# Altium project TP_FINAL.PrjPcb
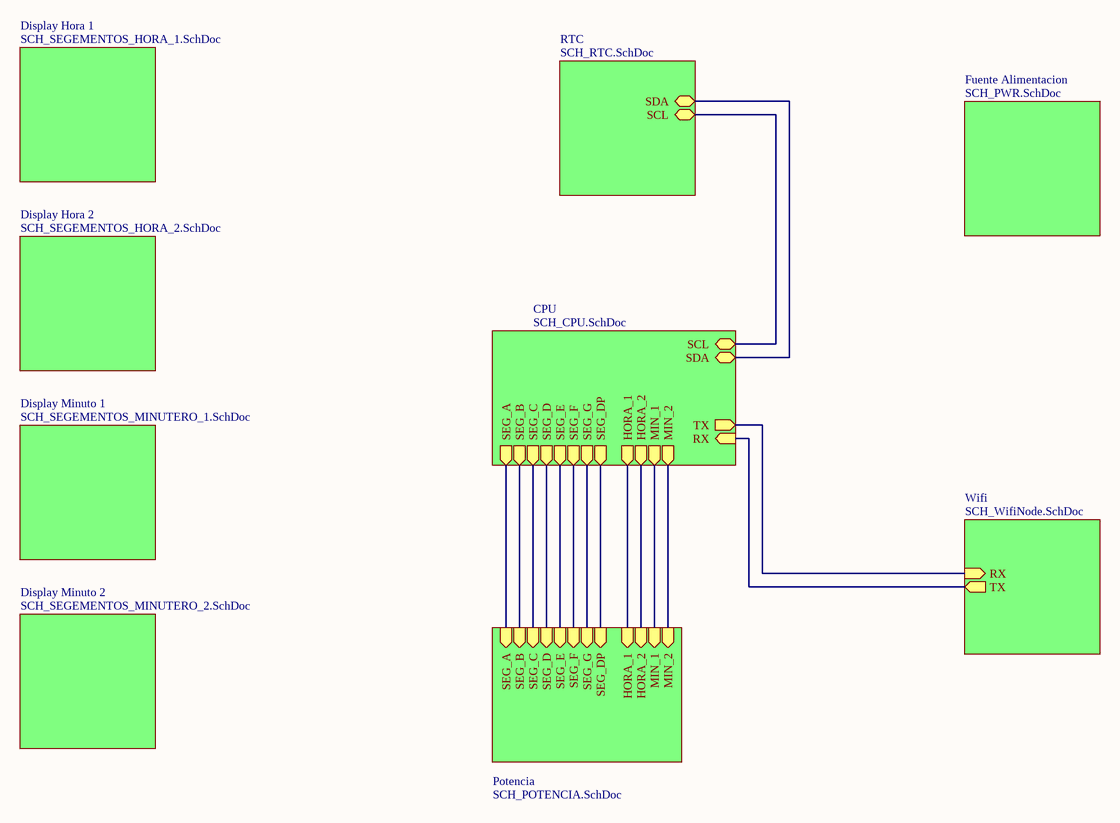
[diagram p0: SCH_TOP.SchDoc]
10 sheets, 493 parts. Net scope: hierarchical (ports join the sheet entries above them; power ports are global).
Sheets:
  SCH_TOP.SchDoc
    Display Hora 2 = SCH_SEGEMENTOS_HORA_2.SchDoc
    CPU = SCH_CPU.SchDoc
    Wifi = SCH_WifiNode.SchDoc
    RTC = SCH_RTC.SchDoc
    Potencia = SCH_POTENCIA.SchDoc
    Display Hora 1 = SCH_SEGEMENTOS_HORA_1.SchDoc
    Display Minuto 1 = SCH_SEGEMENTOS_MINUTERO_1.SchDoc
    Display Minuto 2 = SCH_SEGEMENTOS_MINUTERO_2.SchDoc
    Fuente Alimentacion = SCH_PWR.SchDoc

## Sheet SCH_TOP.SchDoc: TP Final - Reloj - BLK
size A4; Author: Luciano Lopez; CompanyName: UTN - FRBA; Revision: 1; SheetNumber: 1; SheetTotal: 10

### Sub-sheets
CPU = SCH_CPU.SchDoc: SCL (bidir), SDA (bidir), TX (out), RX (in), HORA_2 (out), HORA_1 (out), SEG_G (out), SEG_F (out), SEG_D (out), SEG_E (out), SEG_C (out), SEG_B (out), SEG_A (out), MIN_1 (out), MIN_2 (out), SEG_DP (out)
Display Hora 1 = SCH_SEGEMENTOS_HORA_1.SchDoc: no entries
Display Hora 2 = SCH_SEGEMENTOS_HORA_2.SchDoc: no entries
Display Minuto 1 = SCH_SEGEMENTOS_MINUTERO_1.SchDoc: no entries
Display Minuto 2 = SCH_SEGEMENTOS_MINUTERO_2.SchDoc: no entries
Fuente Alimentacion = SCH_PWR.SchDoc: no entries
Potencia = SCH_POTENCIA.SchDoc: SEG_B (in), SEG_C (in), SEG_D (in), SEG_E (in), SEG_G (in), SEG_F (in), SEG_DP (in), HORA_1 (in), HORA_2 (in), MIN_1 (in), MIN_2 (in), SEG_A (in)
RTC = SCH_RTC.SchDoc: SDA (bidir), SCL (bidir)
Wifi = SCH_WifiNode.SchDoc: TX (out), RX (in)

### Nets
SCL: sheet CPU/SCL, sheet RTC/SCL
SDA: sheet CPU/SDA, sheet RTC/SDA
NetR8_1: sheet CPU/SEG_DP, sheet Potencia/SEG_DP
NetR9_1: sheet CPU/HORA_1, sheet Potencia/HORA_1
NetR12_1: sheet CPU/SEG_A, sheet Potencia/SEG_A
NetR13_1: sheet CPU/HORA_2, sheet Potencia/HORA_2
NetR16_1: sheet CPU/SEG_B, sheet Potencia/SEG_B
NetR17_1: sheet CPU/MIN_1, sheet Potencia/MIN_1
NetR20_1: sheet CPU/SEG_C, sheet Potencia/SEG_C
NetR21_1: sheet CPU/MIN_2, sheet Potencia/MIN_2
NetR24_1: sheet CPU/SEG_D, sheet Potencia/SEG_D
NetR26_1: sheet CPU/SEG_G, sheet Potencia/SEG_G
NetR28_1: sheet CPU/SEG_E, sheet Potencia/SEG_E
NetR30_1: sheet CPU/SEG_F, sheet Potencia/SEG_F
NetU1_30: sheet CPU/RX, sheet Wifi/TX
NetU1_31: sheet CPU/TX, sheet Wifi/RX

### Notes on the sheet
- Title:
- Size:
- Author:
- A4
- Sheet
- of
- Revision:
- File:
- Date:

## Sheet SCH_SEGEMENTOS_HORA_2.SchDoc: TP Final - Reloj - Display Hora 2
size A4; Author: Luciano Lopez; CompanyName: UTN - FRBA; Revision: 1; SheetNumber: 6; SheetTotal: 10
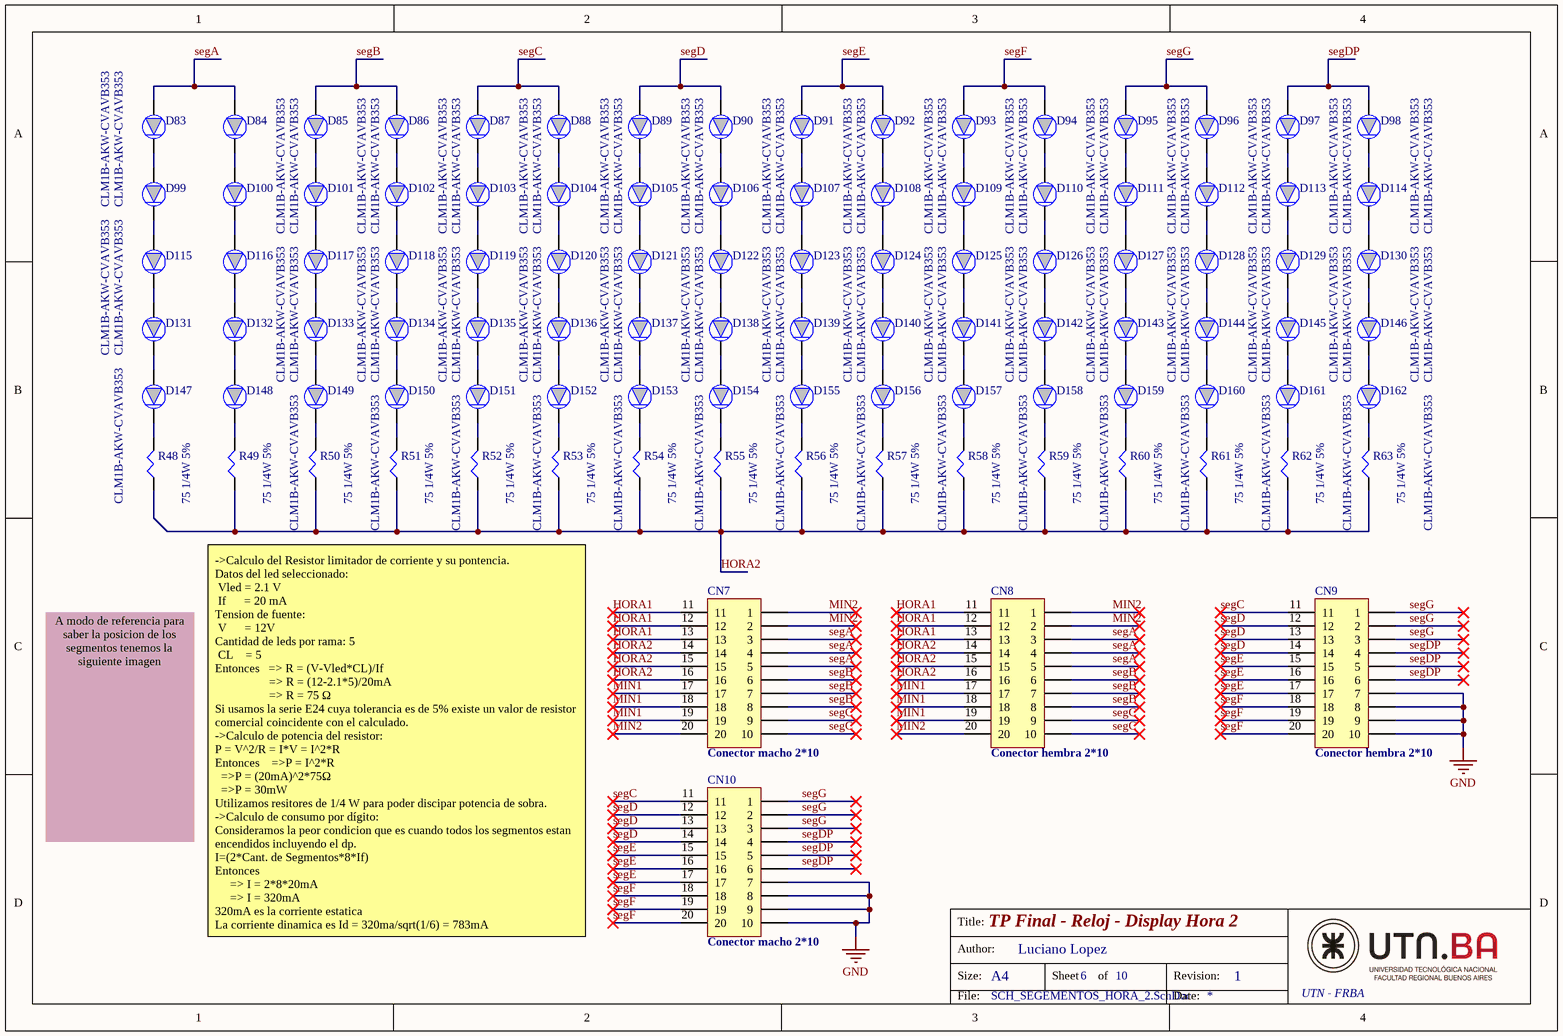
[diagram p1: SCH_SEGEMENTOS_HORA_2.SchDoc]

### Parts
CN7  Conector macho 2*10
CN8  Conector hembra 2*10
CN9  Conector hembra 2*10
CN10  Conector macho 2*10
D83  CLM1B-AKW-CVAVB353  [PLCC2_LED]
D84  CLM1B-AKW-CVAVB353  [PLCC2_LED]
D85  CLM1B-AKW-CVAVB353  [PLCC2_LED]
D86  CLM1B-AKW-CVAVB353  [PLCC2_LED]
D87  CLM1B-AKW-CVAVB353  [PLCC2_LED]
D88  CLM1B-AKW-CVAVB353  [PLCC2_LED]
D89  CLM1B-AKW-CVAVB353  [PLCC2_LED]
D90  CLM1B-AKW-CVAVB353  [PLCC2_LED]
D91  CLM1B-AKW-CVAVB353  [PLCC2_LED]
D92  CLM1B-AKW-CVAVB353  [PLCC2_LED]
D93  CLM1B-AKW-CVAVB353  [PLCC2_LED]
D94  CLM1B-AKW-CVAVB353  [PLCC2_LED]
D95  CLM1B-AKW-CVAVB353  [PLCC2_LED]
D96  CLM1B-AKW-CVAVB353  [PLCC2_LED]
D97  CLM1B-AKW-CVAVB353  [PLCC2_LED]
D98  CLM1B-AKW-CVAVB353  [PLCC2_LED]
D99  CLM1B-AKW-CVAVB353  [PLCC2_LED]
D100  CLM1B-AKW-CVAVB353  [PLCC2_LED]
D101  CLM1B-AKW-CVAVB353  [PLCC2_LED]
D102  CLM1B-AKW-CVAVB353  [PLCC2_LED]
D103  CLM1B-AKW-CVAVB353  [PLCC2_LED]
D104  CLM1B-AKW-CVAVB353  [PLCC2_LED]
D105  CLM1B-AKW-CVAVB353  [PLCC2_LED]
D106  CLM1B-AKW-CVAVB353  [PLCC2_LED]
D107  CLM1B-AKW-CVAVB353  [PLCC2_LED]
D108  CLM1B-AKW-CVAVB353  [PLCC2_LED]
D109  CLM1B-AKW-CVAVB353  [PLCC2_LED]
D110  CLM1B-AKW-CVAVB353  [PLCC2_LED]
D111  CLM1B-AKW-CVAVB353  [PLCC2_LED]
D112  CLM1B-AKW-CVAVB353  [PLCC2_LED]
D113  CLM1B-AKW-CVAVB353  [PLCC2_LED]
D114  CLM1B-AKW-CVAVB353  [PLCC2_LED]
D115  CLM1B-AKW-CVAVB353  [PLCC2_LED]
D116  CLM1B-AKW-CVAVB353  [PLCC2_LED]
D117  CLM1B-AKW-CVAVB353  [PLCC2_LED]
D118  CLM1B-AKW-CVAVB353  [PLCC2_LED]
D119  CLM1B-AKW-CVAVB353  [PLCC2_LED]
D120  CLM1B-AKW-CVAVB353  [PLCC2_LED]
D121  CLM1B-AKW-CVAVB353  [PLCC2_LED]
D122  CLM1B-AKW-CVAVB353  [PLCC2_LED]
D123  CLM1B-AKW-CVAVB353  [PLCC2_LED]
D124  CLM1B-AKW-CVAVB353  [PLCC2_LED]
D125  CLM1B-AKW-CVAVB353  [PLCC2_LED]
D126  CLM1B-AKW-CVAVB353  [PLCC2_LED]
D127  CLM1B-AKW-CVAVB353  [PLCC2_LED]
D128  CLM1B-AKW-CVAVB353  [PLCC2_LED]
D129  CLM1B-AKW-CVAVB353  [PLCC2_LED]
D130  CLM1B-AKW-CVAVB353  [PLCC2_LED]
D131  CLM1B-AKW-CVAVB353  [PLCC2_LED]
D132  CLM1B-AKW-CVAVB353  [PLCC2_LED]
D133  CLM1B-AKW-CVAVB353  [PLCC2_LED]
D134  CLM1B-AKW-CVAVB353  [PLCC2_LED]
D135  CLM1B-AKW-CVAVB353  [PLCC2_LED]
D136  CLM1B-AKW-CVAVB353  [PLCC2_LED]
D137  CLM1B-AKW-CVAVB353  [PLCC2_LED]
D138  CLM1B-AKW-CVAVB353  [PLCC2_LED]
D139  CLM1B-AKW-CVAVB353  [PLCC2_LED]
D140  CLM1B-AKW-CVAVB353  [PLCC2_LED]
D141  CLM1B-AKW-CVAVB353  [PLCC2_LED]
D142  CLM1B-AKW-CVAVB353  [PLCC2_LED]
D143  CLM1B-AKW-CVAVB353  [PLCC2_LED]
D144  CLM1B-AKW-CVAVB353  [PLCC2_LED]
D145  CLM1B-AKW-CVAVB353  [PLCC2_LED]
D146  CLM1B-AKW-CVAVB353  [PLCC2_LED]
D147  CLM1B-AKW-CVAVB353  [PLCC2_LED]
D148  CLM1B-AKW-CVAVB353  [PLCC2_LED]
D149  CLM1B-AKW-CVAVB353  [PLCC2_LED]
D150  CLM1B-AKW-CVAVB353  [PLCC2_LED]
D151  CLM1B-AKW-CVAVB353  [PLCC2_LED]
D152  CLM1B-AKW-CVAVB353  [PLCC2_LED]
D153  CLM1B-AKW-CVAVB353  [PLCC2_LED]
D154  CLM1B-AKW-CVAVB353  [PLCC2_LED]
D155  CLM1B-AKW-CVAVB353  [PLCC2_LED]
D156  CLM1B-AKW-CVAVB353  [PLCC2_LED]
D157  CLM1B-AKW-CVAVB353  [PLCC2_LED]
D158  CLM1B-AKW-CVAVB353  [PLCC2_LED]
D159  CLM1B-AKW-CVAVB353  [PLCC2_LED]
D160  CLM1B-AKW-CVAVB353  [PLCC2_LED]
D161  CLM1B-AKW-CVAVB353  [PLCC2_LED]
D162  CLM1B-AKW-CVAVB353  [PLCC2_LED]
R48  75 1/4W 5%  [R_0805]
R49  75 1/4W 5%  [R_0805]
R50  75 1/4W 5%  [R_0805]
R51  75 1/4W 5%  [R_0805]
R52  75 1/4W 5%  [R_0805]
R53  75 1/4W 5%  [R_0805]
R54  75 1/4W 5%  [R_0805]
R55  75 1/4W 5%  [R_0805]
R56  75 1/4W 5%  [R_0805]
R57  75 1/4W 5%  [R_0805]
R58  75 1/4W 5%  [R_0805]
R59  75 1/4W 5%  [R_0805]
R60  75 1/4W 5%  [R_0805]
R61  75 1/4W 5%  [R_0805]
R62  75 1/4W 5%  [R_0805]
R63  75 1/4W 5%  [R_0805]

### Nets
GND: CN9.7 CN9.8 CN9.9 CN9.10 CN10.7 CN10.8 CN10.9 CN10.10
HORA1: CN7.11 CN7.12 CN7.13 CN8.11 CN8.12 CN8.13
HORA2: CN7.14 CN7.15 CN7.16 CN8.14 CN8.15 CN8.16 R48.47 R49.47 R50.47 R51.47 R52.47 R53.47 R54.47 R55.47 R56.47 R57.47 R58.47 R59.47 R60.47 R61.47 R62.47 R63.47
MIN1: CN7.17 CN7.18 CN7.19 CN8.17 CN8.18 CN8.19
MIN2: CN7.1 CN7.2 CN7.20 CN8.1 CN8.2 CN8.20
segA: CN7.3 CN7.4 CN7.5 CN8.3 CN8.4 CN8.5 D83.12 D84.12
segB: CN7.6 CN7.7 CN7.8 CN8.6 CN8.7 CN8.8 D85.12 D86.12
segC: CN7.9 CN7.10 CN8.9 CN8.10 CN9.11 CN10.11 D87.12 D88.12
segD: CN9.12 CN9.13 CN9.14 CN10.12 CN10.13 CN10.14 D89.12 D90.12
segDP: CN9.4 CN9.5 CN9.6 CN10.4 CN10.5 CN10.6 D97.12 D98.12
segE: CN9.15 CN9.16 CN9.17 CN10.15 CN10.16 CN10.17 D91.12 D92.12
segF: CN9.18 CN9.19 CN9.20 CN10.18 CN10.19 CN10.20 D93.12 D94.12
segG: CN9.1 CN9.2 CN9.3 CN10.1 CN10.2 CN10.3 D95.12 D96.12
NetD83_11: D83.11 D99.12
NetD84_11: D84.11 D100.12
NetD85_11: D85.11 D101.12
NetD86_11: D86.11 D102.12
NetD87_11: D87.11 D103.12
NetD88_11: D88.11 D104.12
NetD89_11: D89.11 D105.12
NetD90_11: D90.11 D106.12
NetD91_11: D91.11 D107.12
NetD92_11: D92.11 D108.12
NetD93_11: D93.11 D109.12
NetD94_11: D94.11 D110.12
NetD95_11: D95.11 D111.12
NetD96_11: D96.11 D112.12
NetD97_11: D97.11 D113.12
NetD98_11: D98.11 D114.12
NetD99_11: D99.11 D115.12
NetD100_11: D100.11 D116.12
NetD101_11: D101.11 D117.12
NetD102_11: D102.11 D118.12
NetD103_11: D103.11 D119.12
NetD104_11: D104.11 D120.12
NetD105_11: D105.11 D121.12
NetD106_11: D106.11 D122.12
NetD107_11: D107.11 D123.12
NetD108_11: D108.11 D124.12
NetD109_11: D109.11 D125.12
NetD110_11: D110.11 D126.12
NetD111_11: D111.11 D127.12
NetD112_11: D112.11 D128.12
NetD113_11: D113.11 D129.12
NetD114_11: D114.11 D130.12
NetD115_11: D115.11 D131.12
NetD116_11: D116.11 D132.12
NetD117_11: D117.11 D133.12
NetD118_11: D118.11 D134.12
NetD119_11: D119.11 D135.12
NetD120_11: D120.11 D136.12
NetD121_11: D121.11 D137.12
NetD122_11: D122.11 D138.12
NetD123_11: D123.11 D139.12
NetD124_11: D124.11 D140.12
NetD125_11: D125.11 D141.12
NetD126_11: D126.11 D142.12
NetD127_11: D127.11 D143.12
NetD128_11: D128.11 D144.12
NetD129_11: D129.11 D145.12
NetD130_11: D130.11 D146.12
NetD131_11: D131.11 D147.12
NetD132_11: D132.11 D148.12
NetD133_11: D133.11 D149.12
NetD134_11: D134.11 D150.12
NetD135_11: D135.11 D151.12
NetD136_11: D136.11 D152.12
NetD137_11: D137.11 D153.12
NetD138_11: D138.11 D154.12
NetD139_11: D139.11 D155.12
NetD140_11: D140.11 D156.12
NetD141_11: D141.11 D157.12
NetD142_11: D142.11 D158.12
NetD143_11: D143.11 D159.12
NetD144_11: D144.11 D160.12
NetD145_11: D145.11 D161.12
NetD146_11: D146.11 D162.12
NetD147_11: D147.11 R48.48
NetD148_11: D148.11 R49.48
NetD149_11: D149.11 R50.48
NetD150_11: D150.11 R51.48
NetD151_11: D151.11 R52.48
NetD152_11: D152.11 R53.48
NetD153_11: D153.11 R54.48
NetD154_11: D154.11 R55.48
NetD155_11: D155.11 R56.48
NetD156_11: D156.11 R57.48
NetD157_11: D157.11 R58.48
NetD158_11: D158.11 R59.48
NetD159_11: D159.11 R60.48
NetD160_11: D160.11 R61.48
NetD161_11: D161.11 R62.48
NetD162_11: D162.11 R63.48

### Notes on the sheet
- A modo de referencia para saber la posicion de los segmentos tenemos la siguiente imagen
- ->Calculo del Resistor limitador de corriente y su pontencia.
  Datos del led seleccionado:
  Vled = 2.1 V
  If      = 20 mA
  Tension de fuente:
  V      = 12V
  Cantidad de leds por rama: 5
  CL    = 5
  Entonces   => R = (V-Vled*CL)/If
  => R = (12-2.1*5)/20mA
  => R = 75 Ω
  Si usamos la serie E24 cuya tolerancia es de 5% existe un valor de resistor comercial coincidente con el calculado.
  ->Calculo de potencia del resistor:
  P = V^2/R = I*V = I^2*R
  Entonces    =>P = I^2*R
  =>P = (20mA)^2*75Ω
  =>P = 30mW
  Utilizamos resitores de 1/4 W para poder discipar potencia de sobra.
  ->Calculo de consumo por dígito:
  Consideramos la peor condicion que es cuando todos los segmentos estan encendidos incluyendo el dp.
  I=(2*Cant. de Segmentos*8*If)
  Entonces
  => I = 2*8*20mA
  => I = 320mA
  320mA es la corriente estatica
  La corriente dinamica es Id = 320ma/sqrt(1/6) = 783mA
- Title:
- Size:
- Author:
- A4
- Sheet
- of
- Revision:
- File:
- Date:

### Library data of the parts
CN7-CN10 = CONN_2x10P: Connector Generic 10 Vias
D83-D162 = LED_DIODE
R48-R63 = Resistor

## Sheet SCH_CPU.SchDoc: TP Final - Reloj - CPU
size A4; Author: Luciano Lopez; CompanyName: UTN - FRBA; Revision: 1; SheetNumber: 2; SheetTotal: 10
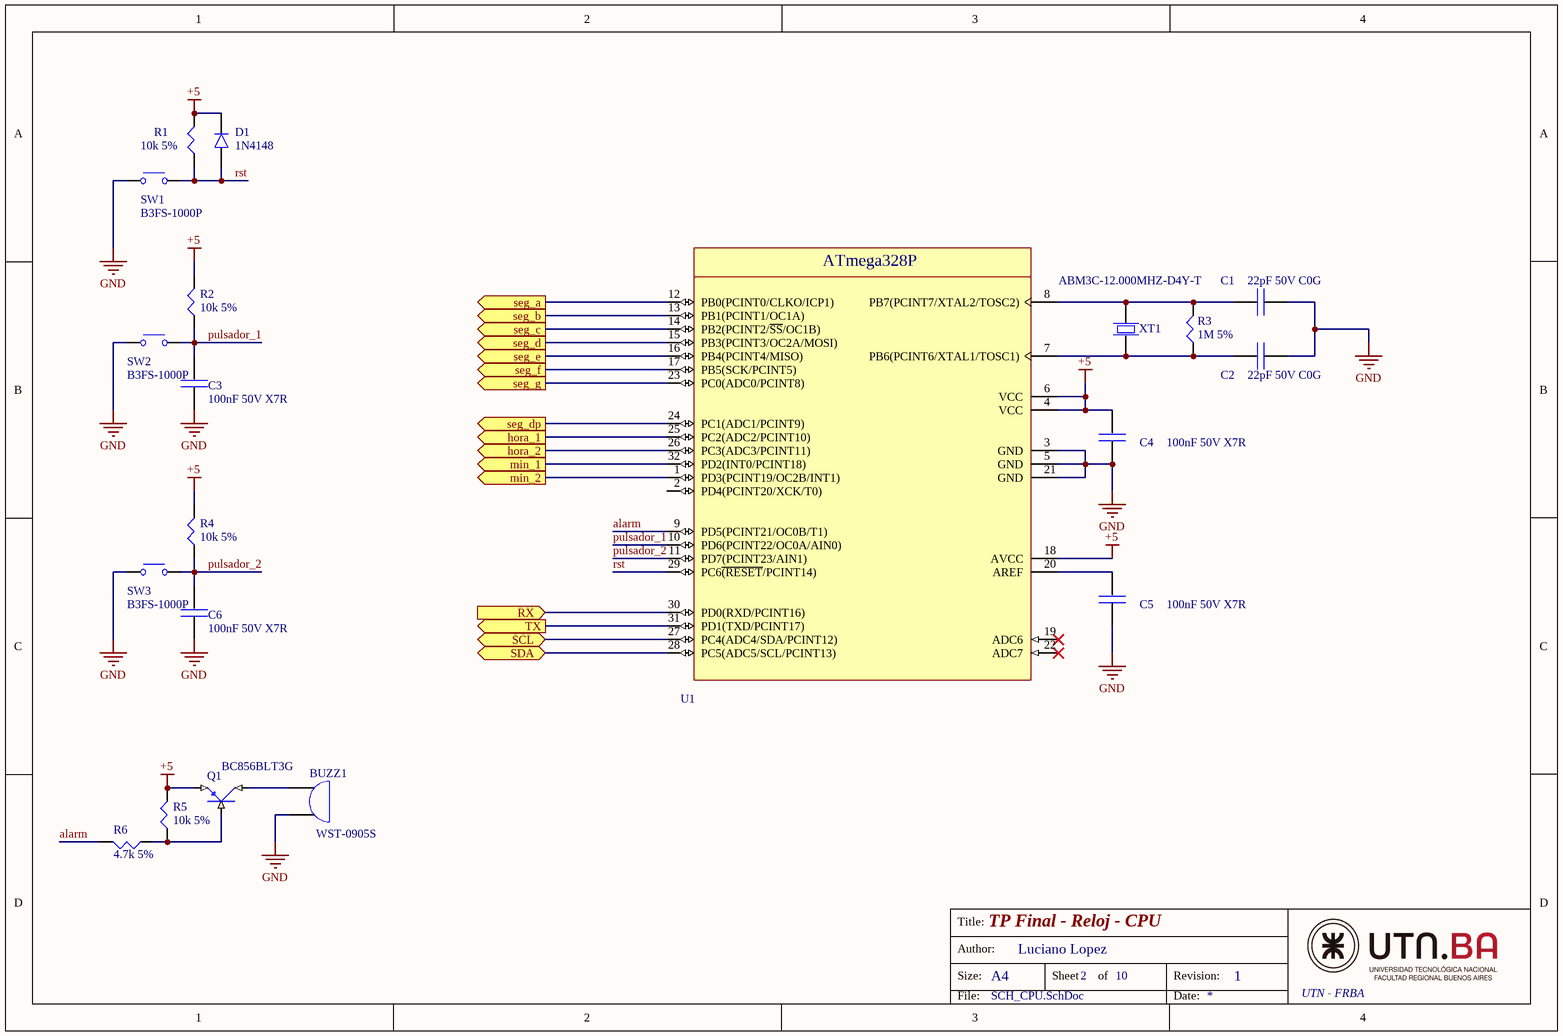
[diagram p2: SCH_CPU.SchDoc]

### Parts
BUZZ1  WST-0905S
C1  22pF 50V C0G  [C_0805]
C2  22pF 50V C0G  [C_0805]
C3  100nF 50V X7R  [C_0805]
C4  100nF 50V X7R  [C_0805]
C5  100nF 50V X7R  [C_0805]
C6  100nF 50V X7R  [C_0805]
D1  1N4148
Q1  BC856BLT3G
R1  10k 5%  [R_0805]
R2  10k 5%  [R_0805]
R3  1M 5%  [R_0805]
R4  10k 5%  [R_0805]
R5  10k 5%  [R_0805]
R6  4.7k 5%  [R_0805]
SW1  B3FS-1000P
SW2  B3FS-1000P
SW3  B3FS-1000P
U1  ATMEGA328P-AUR  (value not drawn)
XT1  ABM3C-12.000MHZ-D4Y-T

### Ports
hora_1 (out), hora_2 (out), min_1 (out), min_2 (out), RX (in), SCL (bidir), SDA (bidir), seg_a (out), seg_b (out), seg_c (out), seg_d (out), seg_dp (out), seg_e (out), seg_f (out), seg_g (out), TX (out)

### Nets
+5: C4.39 D1.35 Q1.3(E) R1.48 R2.48 R4.48 R5.48 U1.4(VCC) U1.6(VCC) U1.18(AVCC)
GND: BUZZ1.27 C1.38 C2.38 C3.38 C4.38 C5.38 C6.38 SW1.7 SW2.7 SW3.7 U1.3(GND) U1.5(GND) U1.21(GND)
alarm: R6.48 U1.9(PD5(PCINT21/OC0B/T1))
pulsador_1: C3.39 R2.47 SW2.6 U1.10(PD6(PCINT22/OC0A/AIN0))
pulsador_2: C6.39 R4.47 SW3.6 U1.11(PD7(PCINT23/AIN1))
rst: D1.34 R1.47 SW1.6 U1.29(PC6~{(RESET}/PCINT14))
SCL: U1.27(PC4(ADC4/SDA/PCINT12)) ; port SCL
SDA: U1.28(PC5(ADC5/SCL/PCINT13)) ; port SDA
NetBUZZ1_26: BUZZ1.26 Q1.2(C)
NetC1_39: C1.39 R3.48 U1.8(PB7(PCINT7/XTAL2/TOSC2)) XT1.4
NetC2_39: C2.39 R3.47 U1.7(PB6(PCINT6/XTAL1/TOSC1)) XT1.5
NetC5_39: C5.39 U1.20(AREF)
NetQ1_1: Q1.1(B) R5.47 R6.47
NetR8_1: U1.24(PC1(ADC1/PCINT9)) ; port seg_dp
NetR9_1: U1.25(PC2(ADC2/PCINT10)) ; port hora_1
NetR12_1: U1.12(PB0(PCINT0/CLKO/ICP1)) ; port seg_a
NetR13_1: U1.26(PC3(ADC3/PCINT11)) ; port hora_2
NetR16_1: U1.13(PB1(PCINT1/OC1A)) ; port seg_b
NetR17_1: U1.32(PD2(INT0/PCINT18)) ; port min_1
NetR20_1: U1.14(PB2(PCINT2/~{SS}/OC1B)) ; port seg_c
NetR21_1: U1.1(PD3(PCINT19/OC2B/INT1)) ; port min_2
NetR24_1: U1.15(PB3(PCINT3/OC2A/MOSI)) ; port seg_d
NetR26_1: U1.23(PC0(ADC0/PCINT8)) ; port seg_g
NetR28_1: U1.16(PB4(PCINT4/MISO)) ; port seg_e
NetR30_1: U1.17(PB5(SCK/PCINT5)) ; port seg_f
NetU1_30: U1.30(PD0(RXD/PCINT16)) ; port RX
NetU1_31: U1.31(PD1(TXD/PCINT17)) ; port TX

Not connected (* = marked no-connect by the designer): U1 2(PD4(PCINT20/XCK/T0)) 19(ADC6)* 22(ADC7)*

### Notes on the sheet
- Title:
- Size:
- Author:
- A4
- Sheet
- of
- Revision:
- File:
- Date:

### Library data of the parts
BUZZ1 = Buzzer
C1-C6 = Capacitor: 100nF x 50v
D1 = Diode: Signal Diode
Q1 = PNP_TRANSISTOR
R1-R6 = Resistor
SW1-SW3 = SWITCH: NO Switch
U1 = ATmega328P: Microcontroller
XT1 = XTAL: crystal piezoelectric

## Sheet SCH_WifiNode.SchDoc: TP Final - Reloj - WifiNode
size A4; Author: Luciano Lopez; CompanyName: UTN-FRBA; Revision: 1; SheetNumber: 9; SheetTotal: 10
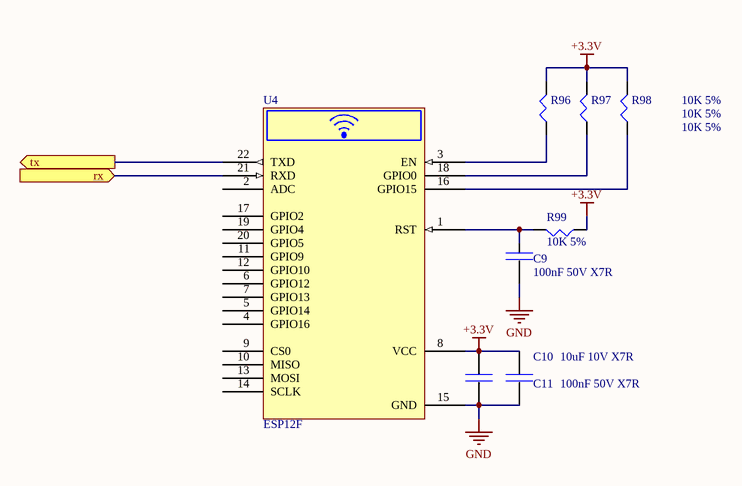
[diagram p3: SCH_WifiNode.SchDoc]

### Parts
C9  100nF 50V X7R  [C_0805]
C10  10uF 10V X7R  [C_0805]
C11  100nF 50V X7R  [C_0805]
R96  10K 5%  [R_0805]
R97  10K 5%  [R_0805]
R98  10K 5%  [R_0805]
R99  10K 5%  [R_0805]
U4  ESP12F  [ESP12F]

### Ports
rx (in), tx (out)

### Nets
+3.3V: C10.2 C11.2 R96.2 R97.2 R98.2 R99.1 U4.8(VCC)
GND: C9.1 C10.1 C11.1 U4.15(GND)
NetC9_2: C9.2 R99.2 U4.1(RST)
NetR96_1: R96.1 U4.3(EN)
NetR97_1: R97.1 U4.18(GPIO0)
NetR98_1: R98.1 U4.16(GPIO15)
NetU1_30: U4.22(TXD) ; port tx
NetU1_31: U4.21(RXD) ; port rx

Not connected (* = marked no-connect by the designer): U4 2(ADC) 4(GPIO16) 5(GPIO14) 6(GPIO12) 7(GPIO13) 9(CS0) 10(MISO) 11(GPIO9) 12(GPIO10) 13(MOSI) 14(SCLK) 17(GPIO2) 19(GPIO4) 20(GPIO5)

### Notes on the sheet
- Title:
- Size:
- Author:
- A4
- Sheet
- of
- Revision:
- File:
- Date:

### Library data of the parts
C9-C11 = CAPACITOR: 100nF x 50v
R96-R99 = Resistor
U4 = ESP12F Wifi Module: Wifi Module

## Sheet SCH_RTC.SchDoc: TP Final - Reloj - RTC
size A4; Author: Luciano Lopez; CompanyName: UTN  - FRBA; Revision: 1; SheetNumber: 3; SheetTotal: 10
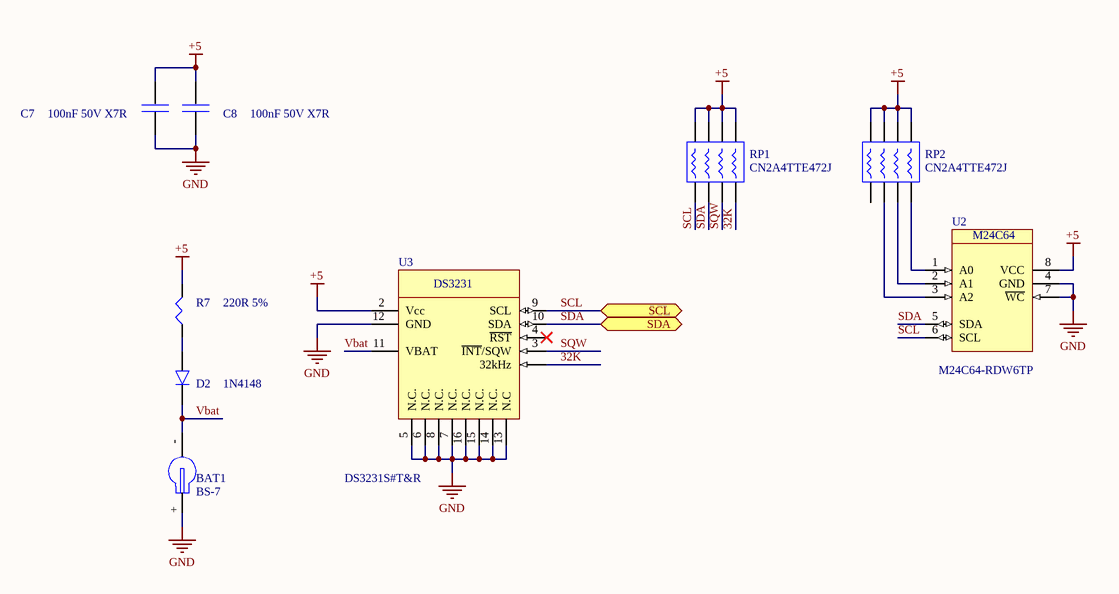
[diagram p4: SCH_RTC.SchDoc]

### Parts
BAT1  BS-7
C7  100nF 50V X7R  [C_0805]
C8  100nF 50V X7R  [C_0805]
D2  1N4148
R7  220R 5%  [R_0805]
RP1  CN2A4TTE472J
RP2  CN2A4TTE472J
U2  M24C64-RDW6TP
U3  DS3231S#T&R

### Ports
SCL (bidir), SDA (bidir)

### Nets
+5: C7.39 C8.39 R7.48 RP1.1 RP1.3 RP1.5 RP1.7 RP2.1 RP2.3 RP2.5 RP2.7 U2.8(VCC) U3.2(Vcc)
GND: BAT1.+ C7.38 C8.38 U2.4(GND) U2.7(~{WC}) U3.5(N.C.) U3.6(N.C.) U3.7(N.C.) U3.8(N.C.) U3.12(GND) U3.13(N.C) U3.14(N.C.) U3.15(N.C.) U3.16(N.C.)
32K: RP1.8 U3.1(32kHz)
SCL: RP1.2 U2.6(SCL) U3.9(SCL) ; port SCL
SDA: RP1.4 U2.5(SDA) U3.10(SDA) ; port SDA
SQW: RP1.6 U3.3(~{INT}/SQW)
Vbat: BAT1.- D2.35 U3.11(VBAT)
NetD2_34: D2.34 R7.47
NetRP2_4: RP2.4 U2.3(A2)
NetRP2_6: RP2.6 U2.2(A1)
NetRP2_8: RP2.8 U2.1(A0)

Not connected (* = marked no-connect by the designer): RP2 2; U3 4(~{RST})*

### Notes on the sheet
- Title:
- Size:
- Author:
- A4
- Sheet
- of
- Revision:
- File:
- Date:
- (in symbol EEPROM) M24C64

### Library data of the parts
BAT1 = BATT: Porta Pila CR2032
C7 C8 = Capacitor: 100nF x 50v
D2 = Diode: Signal Diode
R7 = Resistor
RP1 RP2 = Resistor_PACK
U2 = EEPROM
U3 = DS3231: Real Time Clock

## Sheet SCH_POTENCIA.SchDoc: TP Final - Reloj - Potencia
size A4; Author: Luciano Lopez; CompanyName: UTN - FRBA; Revision: 1; SheetNumber: 4; SheetTotal: 10
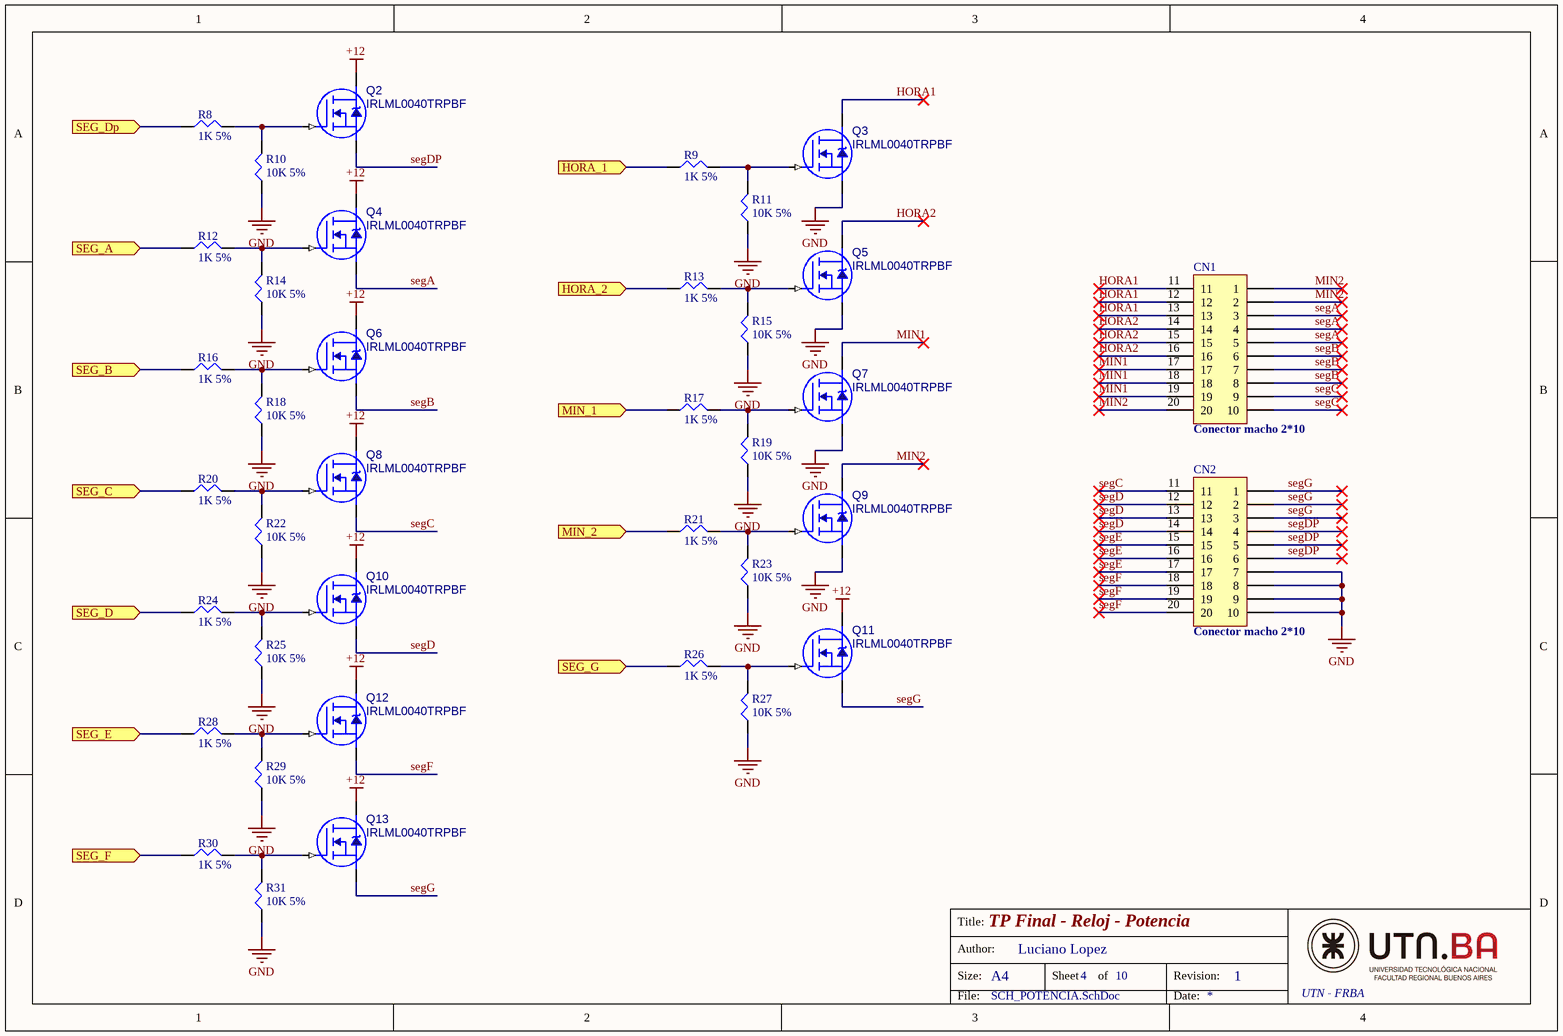
[diagram p5: SCH_POTENCIA.SchDoc]

### Parts
CN1  Conector macho 2*10
CN2  Conector macho 2*10
Q2  IRLML0040TRPBF  [IC_SOT-23]
Q3  IRLML0040TRPBF  [IC_SOT-23]
Q4  IRLML0040TRPBF  [IC_SOT-23]
Q5  IRLML0040TRPBF  [IC_SOT-23]
Q6  IRLML0040TRPBF  [IC_SOT-23]
Q7  IRLML0040TRPBF  [IC_SOT-23]
Q8  IRLML0040TRPBF  [IC_SOT-23]
Q9  IRLML0040TRPBF  [IC_SOT-23]
Q10  IRLML0040TRPBF  [IC_SOT-23]
Q11  IRLML0040TRPBF  [IC_SOT-23]
Q12  IRLML0040TRPBF  [IC_SOT-23]
Q13  IRLML0040TRPBF  [IC_SOT-23]
R8  1K 5%  [R_0805]
R9  1K 5%  [R_0805]
R10  10K 5%  [R_0805]
R11  10K 5%  [R_0805]
R12  1K 5%  [R_0805]
R13  1K 5%  [R_0805]
R14  10K 5%  [R_0805]
R15  10K 5%  [R_0805]
R16  1K 5%  [R_0805]
R17  1K 5%  [R_0805]
R18  10K 5%  [R_0805]
R19  10K 5%  [R_0805]
R20  1K 5%  [R_0805]
R21  1K 5%  [R_0805]
R22  10K 5%  [R_0805]
R23  10K 5%  [R_0805]
R24  1K 5%  [R_0805]
R25  10K 5%  [R_0805]
R26  1K 5%  [R_0805]
R27  10K 5%  [R_0805]
R28  1K 5%  [R_0805]
R29  10K 5%  [R_0805]
R30  1K 5%  [R_0805]
R31  10K 5%  [R_0805]

### Ports
HORA_1 (in), HORA_2 (in), MIN_1 (in), MIN_2 (in), SEG_A (in), SEG_B (in), SEG_C (in), SEG_D (in), SEG_Dp (in), SEG_E (in), SEG_F (in), SEG_G (in)

### Nets
+12: Q2.3(DRAIN) Q4.3(DRAIN) Q6.3(DRAIN) Q8.3(DRAIN) Q10.3(DRAIN) Q11.3(DRAIN) Q12.3(DRAIN) Q13.3(DRAIN)
GND: CN2.7 CN2.8 CN2.9 CN2.10 Q3.2(SOURCE) Q5.2(SOURCE) Q7.2(SOURCE) Q9.2(SOURCE) R10.1 R11.1 R14.1 R15.1 R18.1 R19.1 R22.1 R23.1 R25.1 R27.1 R29.1 R31.1
HORA1: CN1.11 CN1.12 CN1.13 Q3.3(DRAIN)
HORA2: CN1.14 CN1.15 CN1.16 Q5.3(DRAIN)
MIN1: CN1.17 CN1.18 CN1.19 Q7.3(DRAIN)
MIN2: CN1.1 CN1.2 CN1.20 Q9.3(DRAIN)
segA: CN1.3 CN1.4 CN1.5 Q4.2(SOURCE)
segB: CN1.6 CN1.7 CN1.8 Q6.2(SOURCE)
segC: CN1.9 CN1.10 CN2.11 Q8.2(SOURCE)
segD: CN2.12 CN2.13 CN2.14 Q10.2(SOURCE)
segDP: CN2.4 CN2.5 CN2.6 Q2.2(SOURCE)
segE: CN2.15 CN2.16 CN2.17
segF: CN2.18 CN2.19 CN2.20 Q12.2(SOURCE)
segG: CN2.1 CN2.2 CN2.3 Q11.2(SOURCE) Q13.2(SOURCE)
NetQ2_1: Q2.1(GATE) R8.2 R10.2
NetQ3_1: Q3.1(GATE) R9.2 R11.2
NetQ4_1: Q4.1(GATE) R12.2 R14.2
NetQ5_1: Q5.1(GATE) R13.2 R15.2
NetQ6_1: Q6.1(GATE) R16.2 R18.2
NetQ7_1: Q7.1(GATE) R17.2 R19.2
NetQ8_1: Q8.1(GATE) R20.2 R22.2
NetQ9_1: Q9.1(GATE) R21.2 R23.2
NetQ10_1: Q10.1(GATE) R24.2 R25.2
NetQ11_1: Q11.1(GATE) R26.2 R27.2
NetQ12_1: Q12.1(GATE) R28.2 R29.2
NetQ13_1: Q13.1(GATE) R30.2 R31.2
NetR8_1: R8.1 ; port SEG_Dp
NetR9_1: R9.1 ; port HORA_1
NetR12_1: R12.1 ; port SEG_A
NetR13_1: R13.1 ; port HORA_2
NetR16_1: R16.1 ; port SEG_B
NetR17_1: R17.1 ; port MIN_1
NetR20_1: R20.1 ; port SEG_C
NetR21_1: R21.1 ; port MIN_2
NetR24_1: R24.1 ; port SEG_D
NetR26_1: R26.1 ; port SEG_G
NetR28_1: R28.1 ; port SEG_E
NetR30_1: R30.1 ; port SEG_F

### Notes on the sheet
- Title:
- Size:
- Author:
- A4
- Sheet
- of
- Revision:
- File:
- Date:

### Library data of the parts
CN1 CN2 = CONN_2x10P: Connector Generic 10 Vias
Q2-Q13 = N_MOSFET_SOT23: Mosfet N-Ch
R8-R31 = Resistor

## Sheet SCH_SEGEMENTOS_HORA_1.SchDoc: TP Final - Reloj - Display Hora 1
size A4; Author: Luciano Lopez; CompanyName: UTN - FRBA; Revision: 1; SheetNumber: 5; SheetTotal: 10
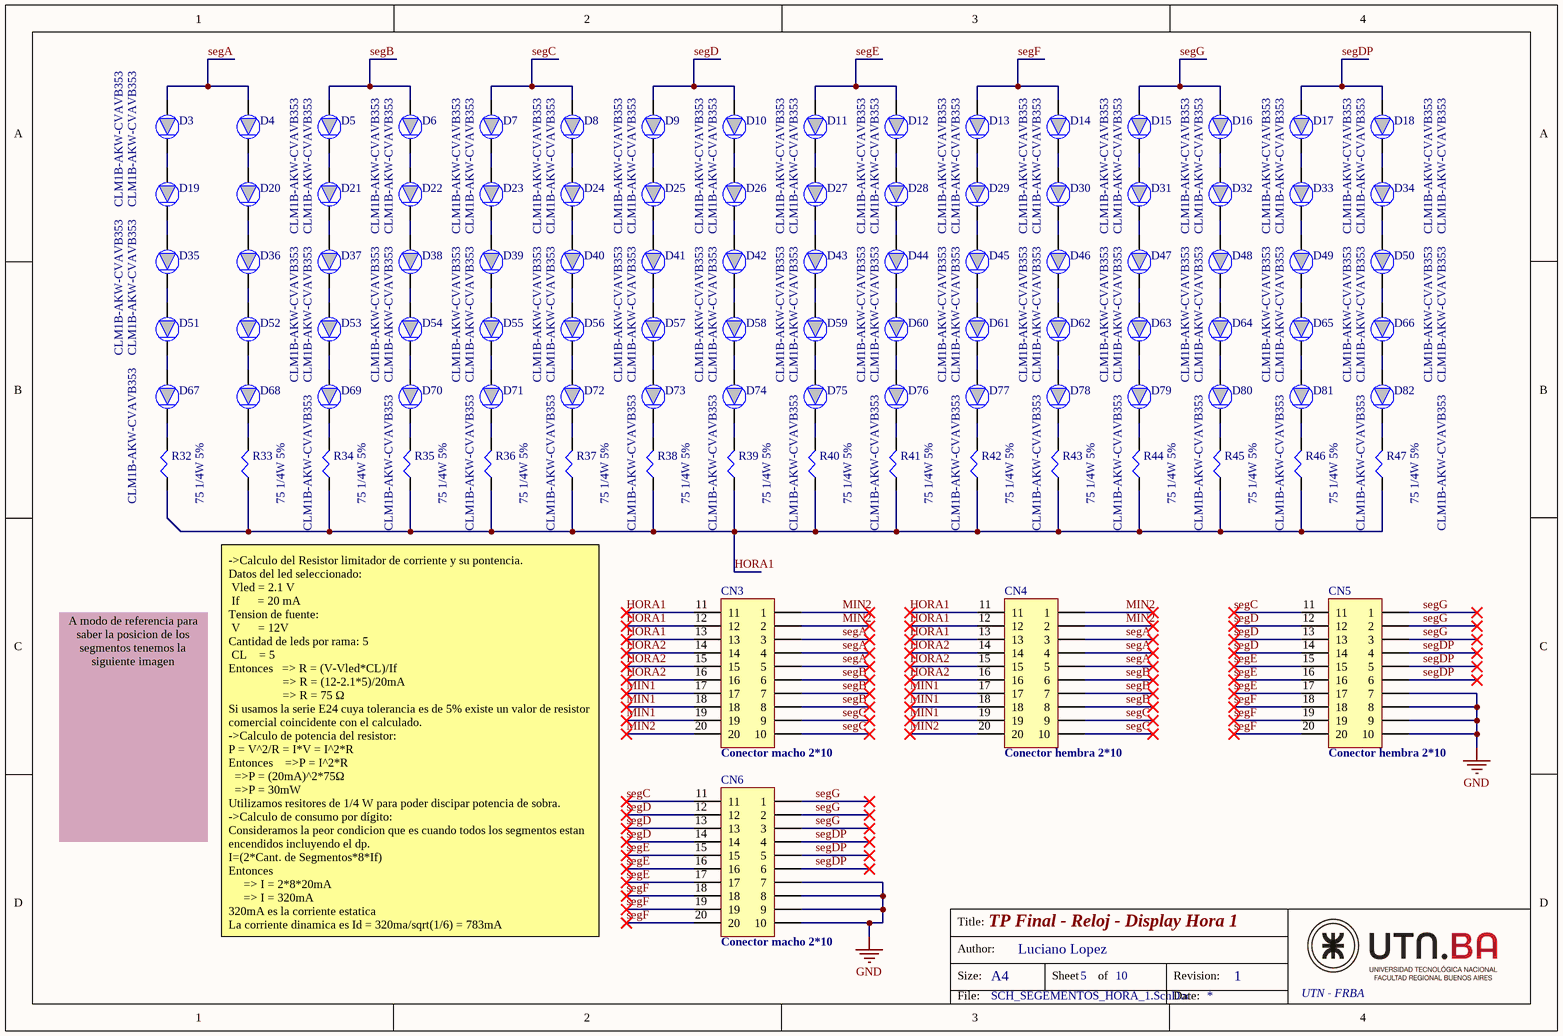
[diagram p6: SCH_SEGEMENTOS_HORA_1.SchDoc]

### Parts
CN3  Conector macho 2*10
CN4  Conector hembra 2*10
CN5  Conector hembra 2*10
CN6  Conector macho 2*10
D3  CLM1B-AKW-CVAVB353  [PLCC2_LED]
D4  CLM1B-AKW-CVAVB353  [PLCC2_LED]
D5  CLM1B-AKW-CVAVB353  [PLCC2_LED]
D6  CLM1B-AKW-CVAVB353  [PLCC2_LED]
D7  CLM1B-AKW-CVAVB353  [PLCC2_LED]
D8  CLM1B-AKW-CVAVB353  [PLCC2_LED]
D9  CLM1B-AKW-CVAVB353  [PLCC2_LED]
D10  CLM1B-AKW-CVAVB353  [PLCC2_LED]
D11  CLM1B-AKW-CVAVB353  [PLCC2_LED]
D12  CLM1B-AKW-CVAVB353  [PLCC2_LED]
D13  CLM1B-AKW-CVAVB353  [PLCC2_LED]
D14  CLM1B-AKW-CVAVB353  [PLCC2_LED]
D15  CLM1B-AKW-CVAVB353  [PLCC2_LED]
D16  CLM1B-AKW-CVAVB353  [PLCC2_LED]
D17  CLM1B-AKW-CVAVB353  [PLCC2_LED]
D18  CLM1B-AKW-CVAVB353  [PLCC2_LED]
D19  CLM1B-AKW-CVAVB353  [PLCC2_LED]
D20  CLM1B-AKW-CVAVB353  [PLCC2_LED]
D21  CLM1B-AKW-CVAVB353  [PLCC2_LED]
D22  CLM1B-AKW-CVAVB353  [PLCC2_LED]
D23  CLM1B-AKW-CVAVB353  [PLCC2_LED]
D24  CLM1B-AKW-CVAVB353  [PLCC2_LED]
D25  CLM1B-AKW-CVAVB353  [PLCC2_LED]
D26  CLM1B-AKW-CVAVB353  [PLCC2_LED]
D27  CLM1B-AKW-CVAVB353  [PLCC2_LED]
D28  CLM1B-AKW-CVAVB353  [PLCC2_LED]
D29  CLM1B-AKW-CVAVB353  [PLCC2_LED]
D30  CLM1B-AKW-CVAVB353  [PLCC2_LED]
D31  CLM1B-AKW-CVAVB353  [PLCC2_LED]
D32  CLM1B-AKW-CVAVB353  [PLCC2_LED]
D33  CLM1B-AKW-CVAVB353  [PLCC2_LED]
D34  CLM1B-AKW-CVAVB353  [PLCC2_LED]
D35  CLM1B-AKW-CVAVB353  [PLCC2_LED]
D36  CLM1B-AKW-CVAVB353  [PLCC2_LED]
D37  CLM1B-AKW-CVAVB353  [PLCC2_LED]
D38  CLM1B-AKW-CVAVB353  [PLCC2_LED]
D39  CLM1B-AKW-CVAVB353  [PLCC2_LED]
D40  CLM1B-AKW-CVAVB353  [PLCC2_LED]
D41  CLM1B-AKW-CVAVB353  [PLCC2_LED]
D42  CLM1B-AKW-CVAVB353  [PLCC2_LED]
D43  CLM1B-AKW-CVAVB353  [PLCC2_LED]
D44  CLM1B-AKW-CVAVB353  [PLCC2_LED]
D45  CLM1B-AKW-CVAVB353  [PLCC2_LED]
D46  CLM1B-AKW-CVAVB353  [PLCC2_LED]
D47  CLM1B-AKW-CVAVB353  [PLCC2_LED]
D48  CLM1B-AKW-CVAVB353  [PLCC2_LED]
D49  CLM1B-AKW-CVAVB353  [PLCC2_LED]
D50  CLM1B-AKW-CVAVB353  [PLCC2_LED]
D51  CLM1B-AKW-CVAVB353  [PLCC2_LED]
D52  CLM1B-AKW-CVAVB353  [PLCC2_LED]
D53  CLM1B-AKW-CVAVB353  [PLCC2_LED]
D54  CLM1B-AKW-CVAVB353  [PLCC2_LED]
D55  CLM1B-AKW-CVAVB353  [PLCC2_LED]
D56  CLM1B-AKW-CVAVB353  [PLCC2_LED]
D57  CLM1B-AKW-CVAVB353  [PLCC2_LED]
D58  CLM1B-AKW-CVAVB353  [PLCC2_LED]
D59  CLM1B-AKW-CVAVB353  [PLCC2_LED]
D60  CLM1B-AKW-CVAVB353  [PLCC2_LED]
D61  CLM1B-AKW-CVAVB353  [PLCC2_LED]
D62  CLM1B-AKW-CVAVB353  [PLCC2_LED]
D63  CLM1B-AKW-CVAVB353  [PLCC2_LED]
D64  CLM1B-AKW-CVAVB353  [PLCC2_LED]
D65  CLM1B-AKW-CVAVB353  [PLCC2_LED]
D66  CLM1B-AKW-CVAVB353  [PLCC2_LED]
D67  CLM1B-AKW-CVAVB353  [PLCC2_LED]
D68  CLM1B-AKW-CVAVB353  [PLCC2_LED]
D69  CLM1B-AKW-CVAVB353  [PLCC2_LED]
D70  CLM1B-AKW-CVAVB353  [PLCC2_LED]
D71  CLM1B-AKW-CVAVB353  [PLCC2_LED]
D72  CLM1B-AKW-CVAVB353  [PLCC2_LED]
D73  CLM1B-AKW-CVAVB353  [PLCC2_LED]
D74  CLM1B-AKW-CVAVB353  [PLCC2_LED]
D75  CLM1B-AKW-CVAVB353  [PLCC2_LED]
D76  CLM1B-AKW-CVAVB353  [PLCC2_LED]
D77  CLM1B-AKW-CVAVB353  [PLCC2_LED]
D78  CLM1B-AKW-CVAVB353  [PLCC2_LED]
D79  CLM1B-AKW-CVAVB353  [PLCC2_LED]
D80  CLM1B-AKW-CVAVB353  [PLCC2_LED]
D81  CLM1B-AKW-CVAVB353  [PLCC2_LED]
D82  CLM1B-AKW-CVAVB353  [PLCC2_LED]
R32  75 1/4W 5%  [R_0805]
R33  75 1/4W 5%  [R_0805]
R34  75 1/4W 5%  [R_0805]
R35  75 1/4W 5%  [R_0805]
R36  75 1/4W 5%  [R_0805]
R37  75 1/4W 5%  [R_0805]
R38  75 1/4W 5%  [R_0805]
R39  75 1/4W 5%  [R_0805]
R40  75 1/4W 5%  [R_0805]
R41  75 1/4W 5%  [R_0805]
R42  75 1/4W 5%  [R_0805]
R43  75 1/4W 5%  [R_0805]
R44  75 1/4W 5%  [R_0805]
R45  75 1/4W 5%  [R_0805]
R46  75 1/4W 5%  [R_0805]
R47  75 1/4W 5%  [R_0805]

### Nets
GND: CN5.7 CN5.8 CN5.9 CN5.10 CN6.7 CN6.8 CN6.9 CN6.10
HORA1: CN3.11 CN3.12 CN3.13 CN4.11 CN4.12 CN4.13 R32.47 R33.47 R34.47 R35.47 R36.47 R37.47 R38.47 R39.47 R40.47 R41.47 R42.47 R43.47 R44.47 R45.47 R46.47 R47.47
HORA2: CN3.14 CN3.15 CN3.16 CN4.14 CN4.15 CN4.16
MIN1: CN3.17 CN3.18 CN3.19 CN4.17 CN4.18 CN4.19
MIN2: CN3.1 CN3.2 CN3.20 CN4.1 CN4.2 CN4.20
segA: CN3.3 CN3.4 CN3.5 CN4.3 CN4.4 CN4.5 D3.12 D4.12
segB: CN3.6 CN3.7 CN3.8 CN4.6 CN4.7 CN4.8 D5.12 D6.12
segC: CN3.9 CN3.10 CN4.9 CN4.10 CN5.11 CN6.11 D7.12 D8.12
segD: CN5.12 CN5.13 CN5.14 CN6.12 CN6.13 CN6.14 D9.12 D10.12
segDP: CN5.4 CN5.5 CN5.6 CN6.4 CN6.5 CN6.6 D17.12 D18.12
segE: CN5.15 CN5.16 CN5.17 CN6.15 CN6.16 CN6.17 D11.12 D12.12
segF: CN5.18 CN5.19 CN5.20 CN6.18 CN6.19 CN6.20 D13.12 D14.12
segG: CN5.1 CN5.2 CN5.3 CN6.1 CN6.2 CN6.3 D15.12 D16.12
NetD3_11: D3.11 D19.12
NetD4_11: D4.11 D20.12
NetD5_11: D5.11 D21.12
NetD6_11: D6.11 D22.12
NetD7_11: D7.11 D23.12
NetD8_11: D8.11 D24.12
NetD9_11: D9.11 D25.12
NetD10_11: D10.11 D26.12
NetD11_11: D11.11 D27.12
NetD12_11: D12.11 D28.12
NetD13_11: D13.11 D29.12
NetD14_11: D14.11 D30.12
NetD15_11: D15.11 D31.12
NetD16_11: D16.11 D32.12
NetD17_11: D17.11 D33.12
NetD18_11: D18.11 D34.12
NetD19_11: D19.11 D35.12
NetD20_11: D20.11 D36.12
NetD21_11: D21.11 D37.12
NetD22_11: D22.11 D38.12
NetD23_11: D23.11 D39.12
NetD24_11: D24.11 D40.12
NetD25_11: D25.11 D41.12
NetD26_11: D26.11 D42.12
NetD27_11: D27.11 D43.12
NetD28_11: D28.11 D44.12
NetD29_11: D29.11 D45.12
NetD30_11: D30.11 D46.12
NetD31_11: D31.11 D47.12
NetD32_11: D32.11 D48.12
NetD33_11: D33.11 D49.12
NetD34_11: D34.11 D50.12
NetD35_11: D35.11 D51.12
NetD36_11: D36.11 D52.12
NetD37_11: D37.11 D53.12
NetD38_11: D38.11 D54.12
NetD39_11: D39.11 D55.12
NetD40_11: D40.11 D56.12
NetD41_11: D41.11 D57.12
NetD42_11: D42.11 D58.12
NetD43_11: D43.11 D59.12
NetD44_11: D44.11 D60.12
NetD45_11: D45.11 D61.12
NetD46_11: D46.11 D62.12
NetD47_11: D47.11 D63.12
NetD48_11: D48.11 D64.12
NetD49_11: D49.11 D65.12
NetD50_11: D50.11 D66.12
NetD51_11: D51.11 D67.12
NetD52_11: D52.11 D68.12
NetD53_11: D53.11 D69.12
NetD54_11: D54.11 D70.12
NetD55_11: D55.11 D71.12
NetD56_11: D56.11 D72.12
NetD57_11: D57.11 D73.12
NetD58_11: D58.11 D74.12
NetD59_11: D59.11 D75.12
NetD60_11: D60.11 D76.12
NetD61_11: D61.11 D77.12
NetD62_11: D62.11 D78.12
NetD63_11: D63.11 D79.12
NetD64_11: D64.11 D80.12
NetD65_11: D65.11 D81.12
NetD66_11: D66.11 D82.12
NetD67_11: D67.11 R32.48
NetD68_11: D68.11 R33.48
NetD69_11: D69.11 R34.48
NetD70_11: D70.11 R35.48
NetD71_11: D71.11 R36.48
NetD72_11: D72.11 R37.48
NetD73_11: D73.11 R38.48
NetD74_11: D74.11 R39.48
NetD75_11: D75.11 R40.48
NetD76_11: D76.11 R41.48
NetD77_11: D77.11 R42.48
NetD78_11: D78.11 R43.48
NetD79_11: D79.11 R44.48
NetD80_11: D80.11 R45.48
NetD81_11: D81.11 R46.48
NetD82_11: D82.11 R47.48

### Notes on the sheet
- A modo de referencia para saber la posicion de los segmentos tenemos la siguiente imagen
- ->Calculo del Resistor limitador de corriente y su pontencia.
  Datos del led seleccionado:
  Vled = 2.1 V
  If      = 20 mA
  Tension de fuente:
  V      = 12V
  Cantidad de leds por rama: 5
  CL    = 5
  Entonces   => R = (V-Vled*CL)/If
  => R = (12-2.1*5)/20mA
  => R = 75 Ω
  Si usamos la serie E24 cuya tolerancia es de 5% existe un valor de resistor comercial coincidente con el calculado.
  ->Calculo de potencia del resistor:
  P = V^2/R = I*V = I^2*R
  Entonces    =>P = I^2*R
  =>P = (20mA)^2*75Ω
  =>P = 30mW
  Utilizamos resitores de 1/4 W para poder discipar potencia de sobra.
  ->Calculo de consumo por dígito:
  Consideramos la peor condicion que es cuando todos los segmentos estan encendidos incluyendo el dp.
  I=(2*Cant. de Segmentos*8*If)
  Entonces
  => I = 2*8*20mA
  => I = 320mA
  320mA es la corriente estatica
  La corriente dinamica es Id = 320ma/sqrt(1/6) = 783mA
- Title:
- Size:
- Author:
- A4
- Sheet
- of
- Revision:
- File:
- Date:

### Library data of the parts
CN3-CN6 = CONN_2x10P: Connector Generic 10 Vias
D3-D82 = LED_DIODE
R32-R47 = Resistor

## Sheet SCH_SEGEMENTOS_MINUTERO_1.SchDoc: TP Final - Reloj - Display Minuto 1
size A4; Author: Luciano Lopez; CompanyName: UTN - FRBA; Revision: 1; SheetNumber: 7; SheetTotal: 10
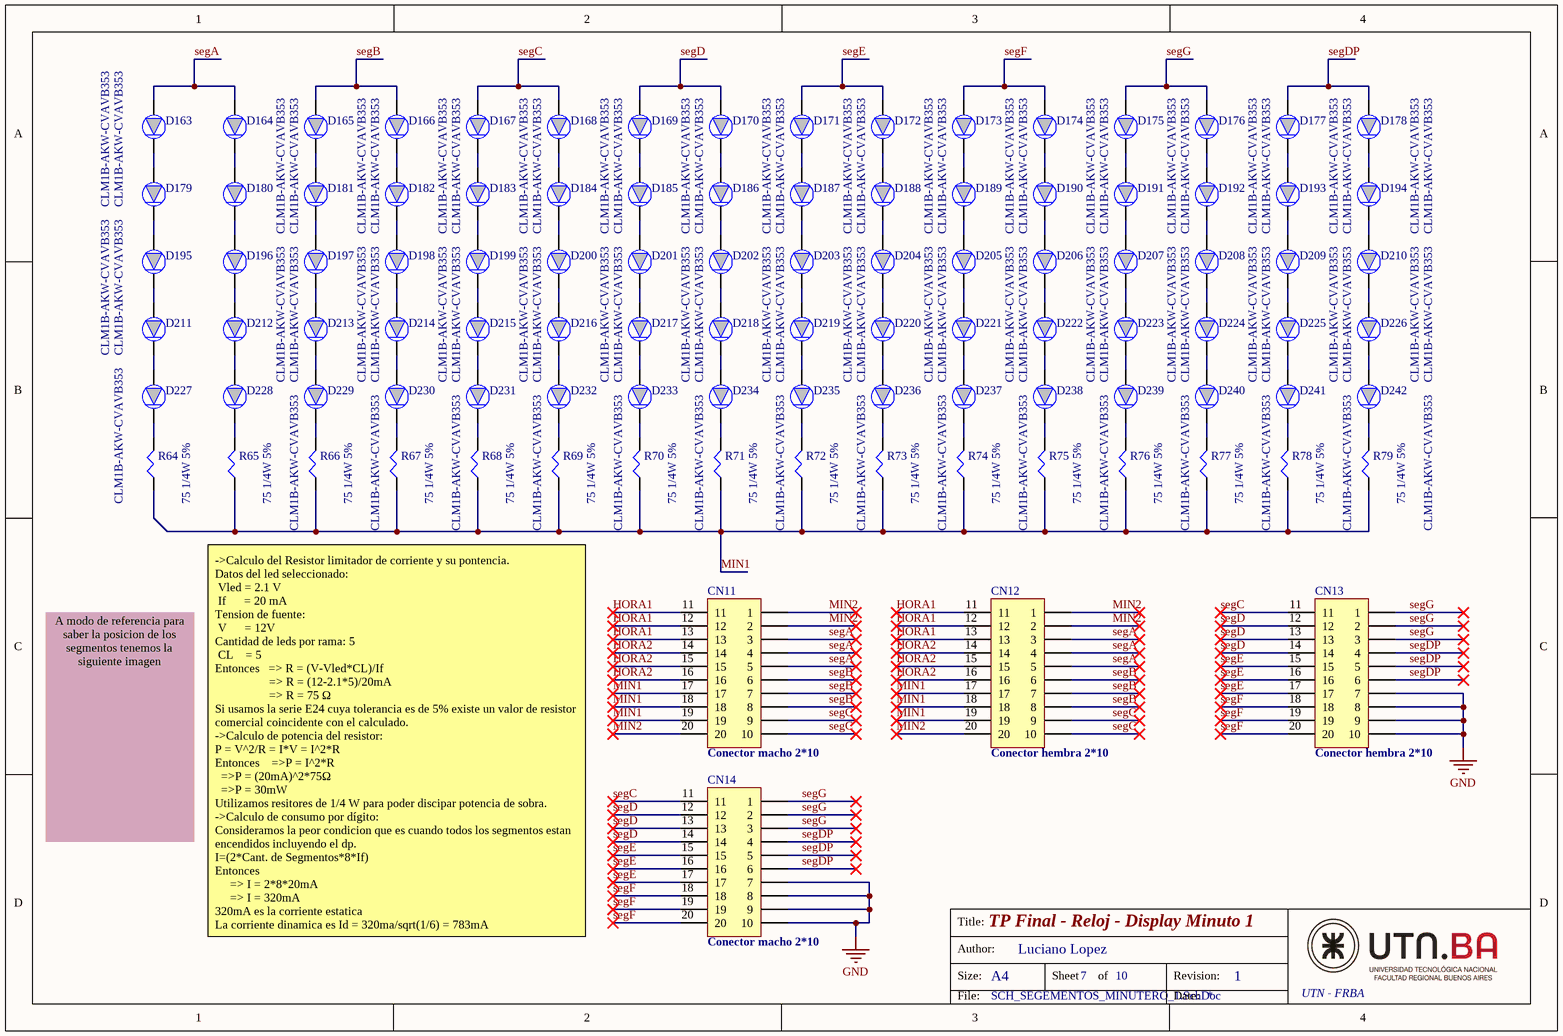
[diagram p7: SCH_SEGEMENTOS_MINUTERO_1.SchDoc]

### Parts
CN11  Conector macho 2*10
CN12  Conector hembra 2*10
CN13  Conector hembra 2*10
CN14  Conector macho 2*10
D163  CLM1B-AKW-CVAVB353  [PLCC2_LED]
D164  CLM1B-AKW-CVAVB353  [PLCC2_LED]
D165  CLM1B-AKW-CVAVB353  [PLCC2_LED]
D166  CLM1B-AKW-CVAVB353  [PLCC2_LED]
D167  CLM1B-AKW-CVAVB353  [PLCC2_LED]
D168  CLM1B-AKW-CVAVB353  [PLCC2_LED]
D169  CLM1B-AKW-CVAVB353  [PLCC2_LED]
D170  CLM1B-AKW-CVAVB353  [PLCC2_LED]
D171  CLM1B-AKW-CVAVB353  [PLCC2_LED]
D172  CLM1B-AKW-CVAVB353  [PLCC2_LED]
D173  CLM1B-AKW-CVAVB353  [PLCC2_LED]
D174  CLM1B-AKW-CVAVB353  [PLCC2_LED]
D175  CLM1B-AKW-CVAVB353  [PLCC2_LED]
D176  CLM1B-AKW-CVAVB353  [PLCC2_LED]
D177  CLM1B-AKW-CVAVB353  [PLCC2_LED]
D178  CLM1B-AKW-CVAVB353  [PLCC2_LED]
D179  CLM1B-AKW-CVAVB353  [PLCC2_LED]
D180  CLM1B-AKW-CVAVB353  [PLCC2_LED]
D181  CLM1B-AKW-CVAVB353  [PLCC2_LED]
D182  CLM1B-AKW-CVAVB353  [PLCC2_LED]
D183  CLM1B-AKW-CVAVB353  [PLCC2_LED]
D184  CLM1B-AKW-CVAVB353  [PLCC2_LED]
D185  CLM1B-AKW-CVAVB353  [PLCC2_LED]
D186  CLM1B-AKW-CVAVB353  [PLCC2_LED]
D187  CLM1B-AKW-CVAVB353  [PLCC2_LED]
D188  CLM1B-AKW-CVAVB353  [PLCC2_LED]
D189  CLM1B-AKW-CVAVB353  [PLCC2_LED]
D190  CLM1B-AKW-CVAVB353  [PLCC2_LED]
D191  CLM1B-AKW-CVAVB353  [PLCC2_LED]
D192  CLM1B-AKW-CVAVB353  [PLCC2_LED]
D193  CLM1B-AKW-CVAVB353  [PLCC2_LED]
D194  CLM1B-AKW-CVAVB353  [PLCC2_LED]
D195  CLM1B-AKW-CVAVB353  [PLCC2_LED]
D196  CLM1B-AKW-CVAVB353  [PLCC2_LED]
D197  CLM1B-AKW-CVAVB353  [PLCC2_LED]
D198  CLM1B-AKW-CVAVB353  [PLCC2_LED]
D199  CLM1B-AKW-CVAVB353  [PLCC2_LED]
D200  CLM1B-AKW-CVAVB353  [PLCC2_LED]
D201  CLM1B-AKW-CVAVB353  [PLCC2_LED]
D202  CLM1B-AKW-CVAVB353  [PLCC2_LED]
D203  CLM1B-AKW-CVAVB353  [PLCC2_LED]
D204  CLM1B-AKW-CVAVB353  [PLCC2_LED]
D205  CLM1B-AKW-CVAVB353  [PLCC2_LED]
D206  CLM1B-AKW-CVAVB353  [PLCC2_LED]
D207  CLM1B-AKW-CVAVB353  [PLCC2_LED]
D208  CLM1B-AKW-CVAVB353  [PLCC2_LED]
D209  CLM1B-AKW-CVAVB353  [PLCC2_LED]
D210  CLM1B-AKW-CVAVB353  [PLCC2_LED]
D211  CLM1B-AKW-CVAVB353  [PLCC2_LED]
D212  CLM1B-AKW-CVAVB353  [PLCC2_LED]
D213  CLM1B-AKW-CVAVB353  [PLCC2_LED]
D214  CLM1B-AKW-CVAVB353  [PLCC2_LED]
D215  CLM1B-AKW-CVAVB353  [PLCC2_LED]
D216  CLM1B-AKW-CVAVB353  [PLCC2_LED]
D217  CLM1B-AKW-CVAVB353  [PLCC2_LED]
D218  CLM1B-AKW-CVAVB353  [PLCC2_LED]
D219  CLM1B-AKW-CVAVB353  [PLCC2_LED]
D220  CLM1B-AKW-CVAVB353  [PLCC2_LED]
D221  CLM1B-AKW-CVAVB353  [PLCC2_LED]
D222  CLM1B-AKW-CVAVB353  [PLCC2_LED]
D223  CLM1B-AKW-CVAVB353  [PLCC2_LED]
D224  CLM1B-AKW-CVAVB353  [PLCC2_LED]
D225  CLM1B-AKW-CVAVB353  [PLCC2_LED]
D226  CLM1B-AKW-CVAVB353  [PLCC2_LED]
D227  CLM1B-AKW-CVAVB353  [PLCC2_LED]
D228  CLM1B-AKW-CVAVB353  [PLCC2_LED]
D229  CLM1B-AKW-CVAVB353  [PLCC2_LED]
D230  CLM1B-AKW-CVAVB353  [PLCC2_LED]
D231  CLM1B-AKW-CVAVB353  [PLCC2_LED]
D232  CLM1B-AKW-CVAVB353  [PLCC2_LED]
D233  CLM1B-AKW-CVAVB353  [PLCC2_LED]
D234  CLM1B-AKW-CVAVB353  [PLCC2_LED]
D235  CLM1B-AKW-CVAVB353  [PLCC2_LED]
D236  CLM1B-AKW-CVAVB353  [PLCC2_LED]
D237  CLM1B-AKW-CVAVB353  [PLCC2_LED]
D238  CLM1B-AKW-CVAVB353  [PLCC2_LED]
D239  CLM1B-AKW-CVAVB353  [PLCC2_LED]
D240  CLM1B-AKW-CVAVB353  [PLCC2_LED]
D241  CLM1B-AKW-CVAVB353  [PLCC2_LED]
D242  CLM1B-AKW-CVAVB353  [PLCC2_LED]
R64  75 1/4W 5%  [R_0805]
R65  75 1/4W 5%  [R_0805]
R66  75 1/4W 5%  [R_0805]
R67  75 1/4W 5%  [R_0805]
R68  75 1/4W 5%  [R_0805]
R69  75 1/4W 5%  [R_0805]
R70  75 1/4W 5%  [R_0805]
R71  75 1/4W 5%  [R_0805]
R72  75 1/4W 5%  [R_0805]
R73  75 1/4W 5%  [R_0805]
R74  75 1/4W 5%  [R_0805]
R75  75 1/4W 5%  [R_0805]
R76  75 1/4W 5%  [R_0805]
R77  75 1/4W 5%  [R_0805]
R78  75 1/4W 5%  [R_0805]
R79  75 1/4W 5%  [R_0805]

### Nets
GND: CN13.7 CN13.8 CN13.9 CN13.10 CN14.7 CN14.8 CN14.9 CN14.10
HORA1: CN11.11 CN11.12 CN11.13 CN12.11 CN12.12 CN12.13
HORA2: CN11.14 CN11.15 CN11.16 CN12.14 CN12.15 CN12.16
MIN1: CN11.17 CN11.18 CN11.19 CN12.17 CN12.18 CN12.19 R64.47 R65.47 R66.47 R67.47 R68.47 R69.47 R70.47 R71.47 R72.47 R73.47 R74.47 R75.47 R76.47 R77.47 R78.47 R79.47
MIN2: CN11.1 CN11.2 CN11.20 CN12.1 CN12.2 CN12.20
segA: CN11.3 CN11.4 CN11.5 CN12.3 CN12.4 CN12.5 D163.12 D164.12
segB: CN11.6 CN11.7 CN11.8 CN12.6 CN12.7 CN12.8 D165.12 D166.12
segC: CN11.9 CN11.10 CN12.9 CN12.10 CN13.11 CN14.11 D167.12 D168.12
segD: CN13.12 CN13.13 CN13.14 CN14.12 CN14.13 CN14.14 D169.12 D170.12
segDP: CN13.4 CN13.5 CN13.6 CN14.4 CN14.5 CN14.6 D177.12 D178.12
segE: CN13.15 CN13.16 CN13.17 CN14.15 CN14.16 CN14.17 D171.12 D172.12
segF: CN13.18 CN13.19 CN13.20 CN14.18 CN14.19 CN14.20 D173.12 D174.12
segG: CN13.1 CN13.2 CN13.3 CN14.1 CN14.2 CN14.3 D175.12 D176.12
NetD163_11: D163.11 D179.12
NetD164_11: D164.11 D180.12
NetD165_11: D165.11 D181.12
NetD166_11: D166.11 D182.12
NetD167_11: D167.11 D183.12
NetD168_11: D168.11 D184.12
NetD169_11: D169.11 D185.12
NetD170_11: D170.11 D186.12
NetD171_11: D171.11 D187.12
NetD172_11: D172.11 D188.12
NetD173_11: D173.11 D189.12
NetD174_11: D174.11 D190.12
NetD175_11: D175.11 D191.12
NetD176_11: D176.11 D192.12
NetD177_11: D177.11 D193.12
NetD178_11: D178.11 D194.12
NetD179_11: D179.11 D195.12
NetD180_11: D180.11 D196.12
NetD181_11: D181.11 D197.12
NetD182_11: D182.11 D198.12
NetD183_11: D183.11 D199.12
NetD184_11: D184.11 D200.12
NetD185_11: D185.11 D201.12
NetD186_11: D186.11 D202.12
NetD187_11: D187.11 D203.12
NetD188_11: D188.11 D204.12
NetD189_11: D189.11 D205.12
NetD190_11: D190.11 D206.12
NetD191_11: D191.11 D207.12
NetD192_11: D192.11 D208.12
NetD193_11: D193.11 D209.12
NetD194_11: D194.11 D210.12
NetD195_11: D195.11 D211.12
NetD196_11: D196.11 D212.12
NetD197_11: D197.11 D213.12
NetD198_11: D198.11 D214.12
NetD199_11: D199.11 D215.12
NetD200_11: D200.11 D216.12
NetD201_11: D201.11 D217.12
NetD202_11: D202.11 D218.12
NetD203_11: D203.11 D219.12
NetD204_11: D204.11 D220.12
NetD205_11: D205.11 D221.12
NetD206_11: D206.11 D222.12
NetD207_11: D207.11 D223.12
NetD208_11: D208.11 D224.12
NetD209_11: D209.11 D225.12
NetD210_11: D210.11 D226.12
NetD211_11: D211.11 D227.12
NetD212_11: D212.11 D228.12
NetD213_11: D213.11 D229.12
NetD214_11: D214.11 D230.12
NetD215_11: D215.11 D231.12
NetD216_11: D216.11 D232.12
NetD217_11: D217.11 D233.12
NetD218_11: D218.11 D234.12
NetD219_11: D219.11 D235.12
NetD220_11: D220.11 D236.12
NetD221_11: D221.11 D237.12
NetD222_11: D222.11 D238.12
NetD223_11: D223.11 D239.12
NetD224_11: D224.11 D240.12
NetD225_11: D225.11 D241.12
NetD226_11: D226.11 D242.12
NetD227_11: D227.11 R64.48
NetD228_11: D228.11 R65.48
NetD229_11: D229.11 R66.48
NetD230_11: D230.11 R67.48
NetD231_11: D231.11 R68.48
NetD232_11: D232.11 R69.48
NetD233_11: D233.11 R70.48
NetD234_11: D234.11 R71.48
NetD235_11: D235.11 R72.48
NetD236_11: D236.11 R73.48
NetD237_11: D237.11 R74.48
NetD238_11: D238.11 R75.48
NetD239_11: D239.11 R76.48
NetD240_11: D240.11 R77.48
NetD241_11: D241.11 R78.48
NetD242_11: D242.11 R79.48

### Notes on the sheet
- A modo de referencia para saber la posicion de los segmentos tenemos la siguiente imagen
- ->Calculo del Resistor limitador de corriente y su pontencia.
  Datos del led seleccionado:
  Vled = 2.1 V
  If      = 20 mA
  Tension de fuente:
  V      = 12V
  Cantidad de leds por rama: 5
  CL    = 5
  Entonces   => R = (V-Vled*CL)/If
  => R = (12-2.1*5)/20mA
  => R = 75 Ω
  Si usamos la serie E24 cuya tolerancia es de 5% existe un valor de resistor comercial coincidente con el calculado.
  ->Calculo de potencia del resistor:
  P = V^2/R = I*V = I^2*R
  Entonces    =>P = I^2*R
  =>P = (20mA)^2*75Ω
  =>P = 30mW
  Utilizamos resitores de 1/4 W para poder discipar potencia de sobra.
  ->Calculo de consumo por dígito:
  Consideramos la peor condicion que es cuando todos los segmentos estan encendidos incluyendo el dp.
  I=(2*Cant. de Segmentos*8*If)
  Entonces
  => I = 2*8*20mA
  => I = 320mA
  320mA es la corriente estatica
  La corriente dinamica es Id = 320ma/sqrt(1/6) = 783mA
- Title:
- Size:
- Author:
- A4
- Sheet
- of
- Revision:
- File:
- Date:

### Library data of the parts
CN11-CN14 = CONN_2x10P: Connector Generic 10 Vias
D163-D242 = LED_DIODE
R64-R79 = Resistor

## Sheet SCH_SEGEMENTOS_MINUTERO_2.SchDoc: TP Final - Reloj - Display Minuto 2
size A4; Author: Luciano Lopez; CompanyName: UTN - FRBA; Revision: 1; SheetNumber: 8; SheetTotal: 10
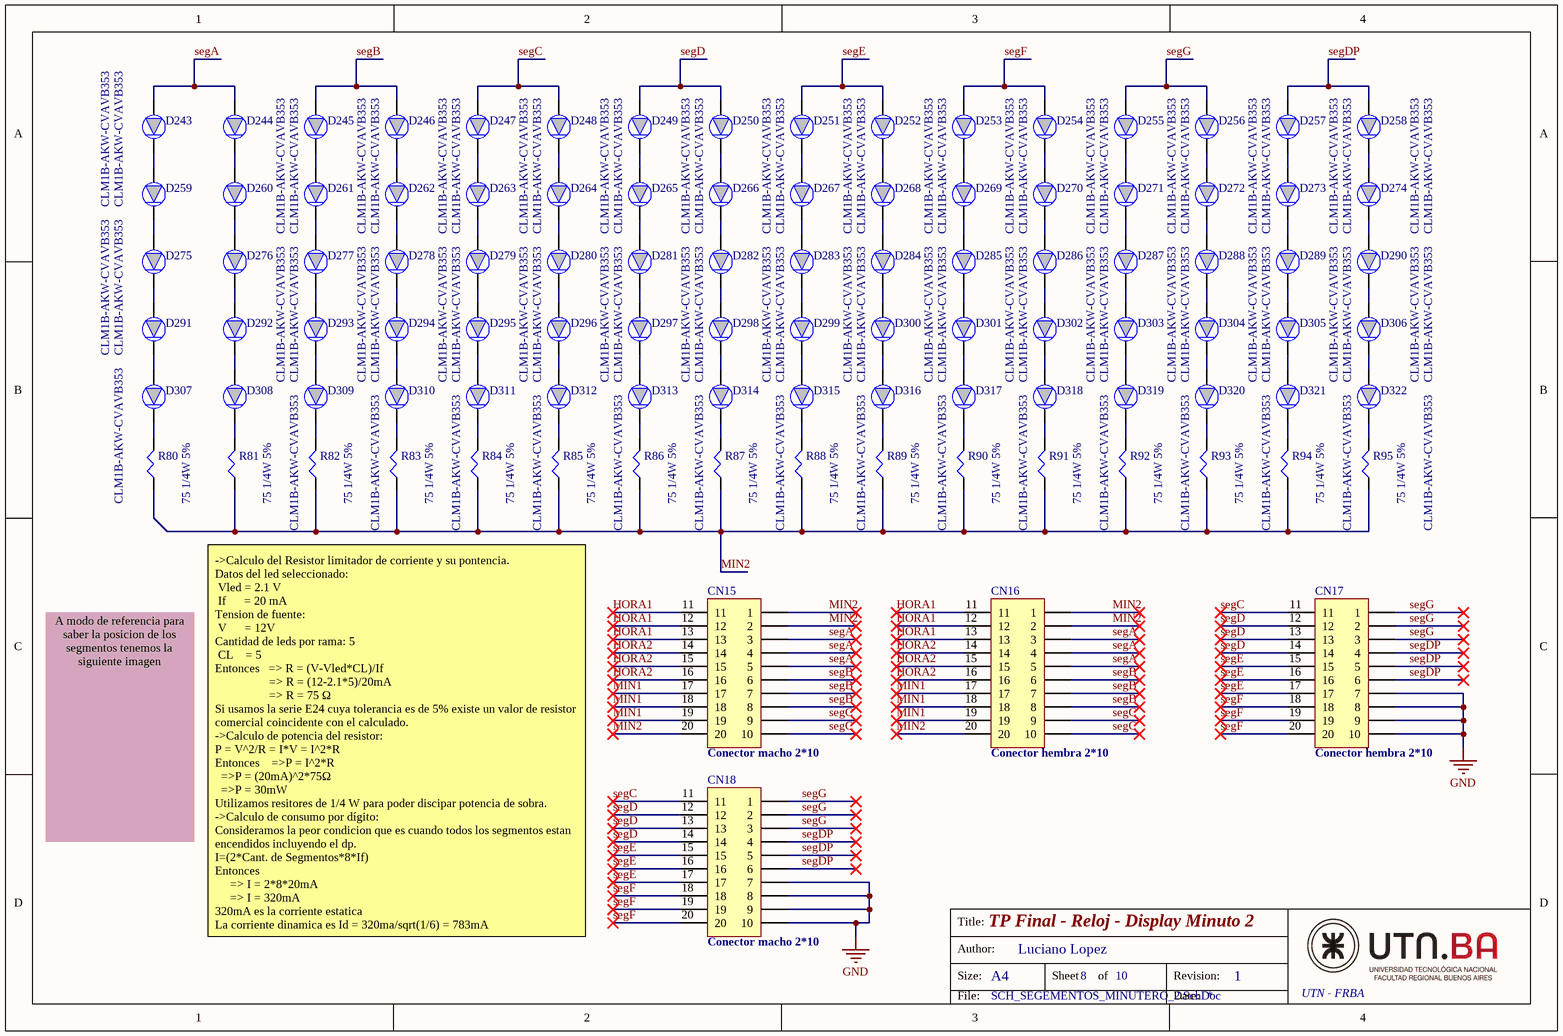
[diagram p8: SCH_SEGEMENTOS_MINUTERO_2.SchDoc]

### Parts
CN15  Conector macho 2*10
CN16  Conector hembra 2*10
CN17  Conector hembra 2*10
CN18  Conector macho 2*10
D243  CLM1B-AKW-CVAVB353  [PLCC2_LED]
D244  CLM1B-AKW-CVAVB353  [PLCC2_LED]
D245  CLM1B-AKW-CVAVB353  [PLCC2_LED]
D246  CLM1B-AKW-CVAVB353  [PLCC2_LED]
D247  CLM1B-AKW-CVAVB353  [PLCC2_LED]
D248  CLM1B-AKW-CVAVB353  [PLCC2_LED]
D249  CLM1B-AKW-CVAVB353  [PLCC2_LED]
D250  CLM1B-AKW-CVAVB353  [PLCC2_LED]
D251  CLM1B-AKW-CVAVB353  [PLCC2_LED]
D252  CLM1B-AKW-CVAVB353  [PLCC2_LED]
D253  CLM1B-AKW-CVAVB353  [PLCC2_LED]
D254  CLM1B-AKW-CVAVB353  [PLCC2_LED]
D255  CLM1B-AKW-CVAVB353  [PLCC2_LED]
D256  CLM1B-AKW-CVAVB353  [PLCC2_LED]
D257  CLM1B-AKW-CVAVB353  [PLCC2_LED]
D258  CLM1B-AKW-CVAVB353  [PLCC2_LED]
D259  CLM1B-AKW-CVAVB353  [PLCC2_LED]
D260  CLM1B-AKW-CVAVB353  [PLCC2_LED]
D261  CLM1B-AKW-CVAVB353  [PLCC2_LED]
D262  CLM1B-AKW-CVAVB353  [PLCC2_LED]
D263  CLM1B-AKW-CVAVB353  [PLCC2_LED]
D264  CLM1B-AKW-CVAVB353  [PLCC2_LED]
D265  CLM1B-AKW-CVAVB353  [PLCC2_LED]
D266  CLM1B-AKW-CVAVB353  [PLCC2_LED]
D267  CLM1B-AKW-CVAVB353  [PLCC2_LED]
D268  CLM1B-AKW-CVAVB353  [PLCC2_LED]
D269  CLM1B-AKW-CVAVB353  [PLCC2_LED]
D270  CLM1B-AKW-CVAVB353  [PLCC2_LED]
D271  CLM1B-AKW-CVAVB353  [PLCC2_LED]
D272  CLM1B-AKW-CVAVB353  [PLCC2_LED]
D273  CLM1B-AKW-CVAVB353  [PLCC2_LED]
D274  CLM1B-AKW-CVAVB353  [PLCC2_LED]
D275  CLM1B-AKW-CVAVB353  [PLCC2_LED]
D276  CLM1B-AKW-CVAVB353  [PLCC2_LED]
D277  CLM1B-AKW-CVAVB353  [PLCC2_LED]
D278  CLM1B-AKW-CVAVB353  [PLCC2_LED]
D279  CLM1B-AKW-CVAVB353  [PLCC2_LED]
D280  CLM1B-AKW-CVAVB353  [PLCC2_LED]
D281  CLM1B-AKW-CVAVB353  [PLCC2_LED]
D282  CLM1B-AKW-CVAVB353  [PLCC2_LED]
D283  CLM1B-AKW-CVAVB353  [PLCC2_LED]
D284  CLM1B-AKW-CVAVB353  [PLCC2_LED]
D285  CLM1B-AKW-CVAVB353  [PLCC2_LED]
D286  CLM1B-AKW-CVAVB353  [PLCC2_LED]
D287  CLM1B-AKW-CVAVB353  [PLCC2_LED]
D288  CLM1B-AKW-CVAVB353  [PLCC2_LED]
D289  CLM1B-AKW-CVAVB353  [PLCC2_LED]
D290  CLM1B-AKW-CVAVB353  [PLCC2_LED]
D291  CLM1B-AKW-CVAVB353  [PLCC2_LED]
D292  CLM1B-AKW-CVAVB353  [PLCC2_LED]
D293  CLM1B-AKW-CVAVB353  [PLCC2_LED]
D294  CLM1B-AKW-CVAVB353  [PLCC2_LED]
D295  CLM1B-AKW-CVAVB353  [PLCC2_LED]
D296  CLM1B-AKW-CVAVB353  [PLCC2_LED]
D297  CLM1B-AKW-CVAVB353  [PLCC2_LED]
D298  CLM1B-AKW-CVAVB353  [PLCC2_LED]
D299  CLM1B-AKW-CVAVB353  [PLCC2_LED]
D300  CLM1B-AKW-CVAVB353  [PLCC2_LED]
D301  CLM1B-AKW-CVAVB353  [PLCC2_LED]
D302  CLM1B-AKW-CVAVB353  [PLCC2_LED]
D303  CLM1B-AKW-CVAVB353  [PLCC2_LED]
D304  CLM1B-AKW-CVAVB353  [PLCC2_LED]
D305  CLM1B-AKW-CVAVB353  [PLCC2_LED]
D306  CLM1B-AKW-CVAVB353  [PLCC2_LED]
D307  CLM1B-AKW-CVAVB353  [PLCC2_LED]
D308  CLM1B-AKW-CVAVB353  [PLCC2_LED]
D309  CLM1B-AKW-CVAVB353  [PLCC2_LED]
D310  CLM1B-AKW-CVAVB353  [PLCC2_LED]
D311  CLM1B-AKW-CVAVB353  [PLCC2_LED]
D312  CLM1B-AKW-CVAVB353  [PLCC2_LED]
D313  CLM1B-AKW-CVAVB353  [PLCC2_LED]
D314  CLM1B-AKW-CVAVB353  [PLCC2_LED]
D315  CLM1B-AKW-CVAVB353  [PLCC2_LED]
D316  CLM1B-AKW-CVAVB353  [PLCC2_LED]
D317  CLM1B-AKW-CVAVB353  [PLCC2_LED]
D318  CLM1B-AKW-CVAVB353  [PLCC2_LED]
D319  CLM1B-AKW-CVAVB353  [PLCC2_LED]
D320  CLM1B-AKW-CVAVB353  [PLCC2_LED]
D321  CLM1B-AKW-CVAVB353  [PLCC2_LED]
D322  CLM1B-AKW-CVAVB353  [PLCC2_LED]
R80  75 1/4W 5%  [R_0805]
R81  75 1/4W 5%  [R_0805]
R82  75 1/4W 5%  [R_0805]
R83  75 1/4W 5%  [R_0805]
R84  75 1/4W 5%  [R_0805]
R85  75 1/4W 5%  [R_0805]
R86  75 1/4W 5%  [R_0805]
R87  75 1/4W 5%  [R_0805]
R88  75 1/4W 5%  [R_0805]
R89  75 1/4W 5%  [R_0805]
R90  75 1/4W 5%  [R_0805]
R91  75 1/4W 5%  [R_0805]
R92  75 1/4W 5%  [R_0805]
R93  75 1/4W 5%  [R_0805]
R94  75 1/4W 5%  [R_0805]
R95  75 1/4W 5%  [R_0805]

### Nets
GND: CN17.7 CN17.8 CN17.9 CN17.10 CN18.7 CN18.8 CN18.9 CN18.10
HORA1: CN15.11 CN15.12 CN15.13 CN16.11 CN16.12 CN16.13
HORA2: CN15.14 CN15.15 CN15.16 CN16.14 CN16.15 CN16.16
MIN1: CN15.17 CN15.18 CN15.19 CN16.17 CN16.18 CN16.19
MIN2: CN15.1 CN15.2 CN15.20 CN16.1 CN16.2 CN16.20 R80.47 R81.47 R82.47 R83.47 R84.47 R85.47 R86.47 R87.47 R88.47 R89.47 R90.47 R91.47 R92.47 R93.47 R94.47 R95.47
segA: CN15.3 CN15.4 CN15.5 CN16.3 CN16.4 CN16.5 D243.12 D244.12
segB: CN15.6 CN15.7 CN15.8 CN16.6 CN16.7 CN16.8 D245.12 D246.12
segC: CN15.9 CN15.10 CN16.9 CN16.10 CN17.11 CN18.11 D247.12 D248.12
segD: CN17.12 CN17.13 CN17.14 CN18.12 CN18.13 CN18.14 D249.12 D250.12
segDP: CN17.4 CN17.5 CN17.6 CN18.4 CN18.5 CN18.6 D257.12 D258.12
segE: CN17.15 CN17.16 CN17.17 CN18.15 CN18.16 CN18.17 D251.12 D252.12
segF: CN17.18 CN17.19 CN17.20 CN18.18 CN18.19 CN18.20 D253.12 D254.12
segG: CN17.1 CN17.2 CN17.3 CN18.1 CN18.2 CN18.3 D255.12 D256.12
NetD243_11: D243.11 D259.12
NetD244_11: D244.11 D260.12
NetD245_11: D245.11 D261.12
NetD246_11: D246.11 D262.12
NetD247_11: D247.11 D263.12
NetD248_11: D248.11 D264.12
NetD249_11: D249.11 D265.12
NetD250_11: D250.11 D266.12
NetD251_11: D251.11 D267.12
NetD252_11: D252.11 D268.12
NetD253_11: D253.11 D269.12
NetD254_11: D254.11 D270.12
NetD255_11: D255.11 D271.12
NetD256_11: D256.11 D272.12
NetD257_11: D257.11 D273.12
NetD258_11: D258.11 D274.12
NetD259_11: D259.11 D275.12
NetD260_11: D260.11 D276.12
NetD261_11: D261.11 D277.12
NetD262_11: D262.11 D278.12
NetD263_11: D263.11 D279.12
NetD264_11: D264.11 D280.12
NetD265_11: D265.11 D281.12
NetD266_11: D266.11 D282.12
NetD267_11: D267.11 D283.12
NetD268_11: D268.11 D284.12
NetD269_11: D269.11 D285.12
NetD270_11: D270.11 D286.12
NetD271_11: D271.11 D287.12
NetD272_11: D272.11 D288.12
NetD273_11: D273.11 D289.12
NetD274_11: D274.11 D290.12
NetD275_11: D275.11 D291.12
NetD276_11: D276.11 D292.12
NetD277_11: D277.11 D293.12
NetD278_11: D278.11 D294.12
NetD279_11: D279.11 D295.12
NetD280_11: D280.11 D296.12
NetD281_11: D281.11 D297.12
NetD282_11: D282.11 D298.12
NetD283_11: D283.11 D299.12
NetD284_11: D284.11 D300.12
NetD285_11: D285.11 D301.12
NetD286_11: D286.11 D302.12
NetD287_11: D287.11 D303.12
NetD288_11: D288.11 D304.12
NetD289_11: D289.11 D305.12
NetD290_11: D290.11 D306.12
NetD291_11: D291.11 D307.12
NetD292_11: D292.11 D308.12
NetD293_11: D293.11 D309.12
NetD294_11: D294.11 D310.12
NetD295_11: D295.11 D311.12
NetD296_11: D296.11 D312.12
NetD297_11: D297.11 D313.12
NetD298_11: D298.11 D314.12
NetD299_11: D299.11 D315.12
NetD300_11: D300.11 D316.12
NetD301_11: D301.11 D317.12
NetD302_11: D302.11 D318.12
NetD303_11: D303.11 D319.12
NetD304_11: D304.11 D320.12
NetD305_11: D305.11 D321.12
NetD306_11: D306.11 D322.12
NetD307_11: D307.11 R80.48
NetD308_11: D308.11 R81.48
NetD309_11: D309.11 R82.48
NetD310_11: D310.11 R83.48
NetD311_11: D311.11 R84.48
NetD312_11: D312.11 R85.48
NetD313_11: D313.11 R86.48
NetD314_11: D314.11 R87.48
NetD315_11: D315.11 R88.48
NetD316_11: D316.11 R89.48
NetD317_11: D317.11 R90.48
NetD318_11: D318.11 R91.48
NetD319_11: D319.11 R92.48
NetD320_11: D320.11 R93.48
NetD321_11: D321.11 R94.48
NetD322_11: D322.11 R95.48

### Notes on the sheet
- A modo de referencia para saber la posicion de los segmentos tenemos la siguiente imagen
- ->Calculo del Resistor limitador de corriente y su pontencia.
  Datos del led seleccionado:
  Vled = 2.1 V
  If      = 20 mA
  Tension de fuente:
  V      = 12V
  Cantidad de leds por rama: 5
  CL    = 5
  Entonces   => R = (V-Vled*CL)/If
  => R = (12-2.1*5)/20mA
  => R = 75 Ω
  Si usamos la serie E24 cuya tolerancia es de 5% existe un valor de resistor comercial coincidente con el calculado.
  ->Calculo de potencia del resistor:
  P = V^2/R = I*V = I^2*R
  Entonces    =>P = I^2*R
  =>P = (20mA)^2*75Ω
  =>P = 30mW
  Utilizamos resitores de 1/4 W para poder discipar potencia de sobra.
  ->Calculo de consumo por dígito:
  Consideramos la peor condicion que es cuando todos los segmentos estan encendidos incluyendo el dp.
  I=(2*Cant. de Segmentos*8*If)
  Entonces
  => I = 2*8*20mA
  => I = 320mA
  320mA es la corriente estatica
  La corriente dinamica es Id = 320ma/sqrt(1/6) = 783mA
- Title:
- Size:
- Author:
- A4
- Sheet
- of
- Revision:
- File:
- Date:

### Library data of the parts
CN15-CN18 = CONN_2x10P: Connector Generic 10 Vias
D243-D322 = LED_DIODE
R80-R95 = Resistor

## Sheet SCH_PWR.SchDoc: TP Final - Reloj - PWR
size A4; Author: Luciano Lopez; CompanyName: UTN - FRBA; Revision: 1; SheetNumber: 10; SheetTotal: 10
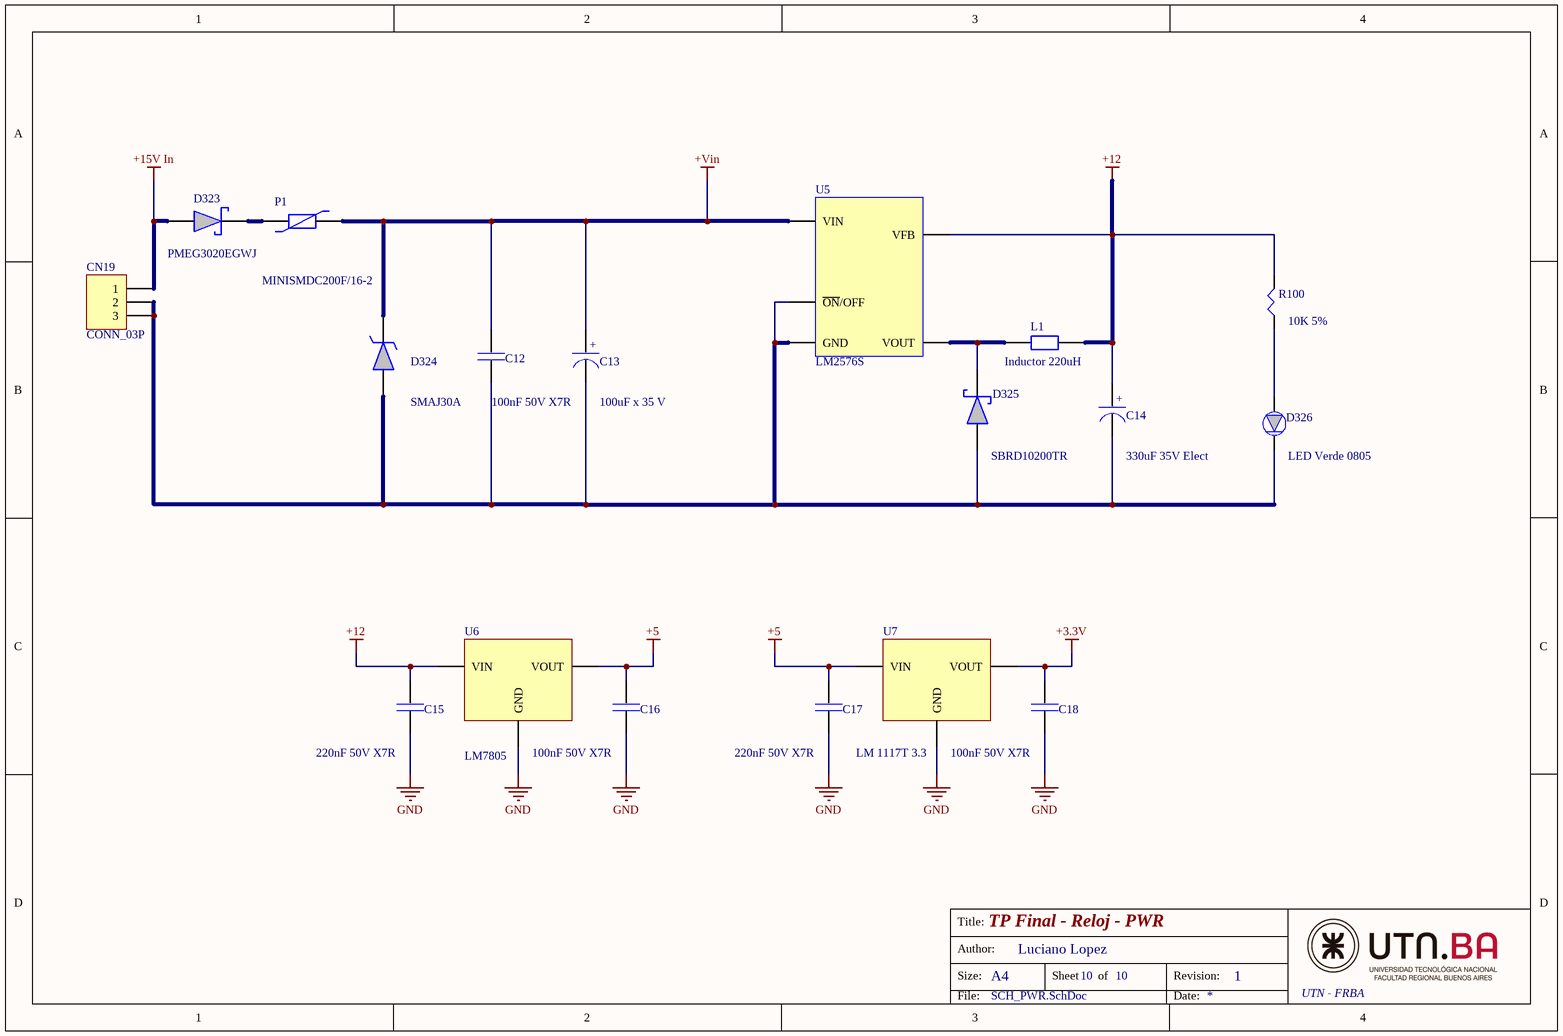
[diagram p9: SCH_PWR.SchDoc]

### Parts
C12  100nF 50V X7R  [C_0805]
C13  100uF x 35 V  [C_220ufx35V]
C14  330uF 35V Elect  [C_220ufx35V]
C15  220nF 50V X7R  [C_0805]
C16  100nF 50V X7R  [C_0805]
C17  220nF 50V X7R  [C_0805]
C18  100nF 50V X7R  [C_0805]
CN19  CONN_03P  [JACK_2.5mm_F]
D323  PMEG3020EGWJ
D324  SMAJ30A
D325  SBRD10200TR
D326  LED Verde 0805  [LED_0805]
L1  Inductor 220uH
P1  MINISMDC200F/16-2
R100  10K 5%  [R_0805]
U5  LM2576S
U6  LM7805
U7  LM 1117T 3.3

### Nets
+3.3V: C18.1 U7.3(VOUT)
+5: C16.1 C17.1 U6.3(VOUT) U7.1(VIN)
+12: C14.1 C15.1 L1.2 R100.2 U5.4(VFB) U6.1(VIN)
+15V In: CN19.1 D323.1
+Vin: C12.1 C13.1 D324.2 P1.2 U5.1(VIN)
GND: C15.2 C16.2 C17.2 C18.2 U6.2(GND) U7.2(GND)
NetC12_2: C12.2 C13.2 C14.2 CN19.2 CN19.3 D324.1 D325.1 D326.2 U5.3(GND) U5.5(~{ON}/OFF)
NetD323_2: D323.2 P1.1
NetD325_2: D325.2 L1.1 U5.2(VOUT)
NetD326_1: D326.1 R100.1

### Notes on the sheet
- Title:
- Size:
- Author:
- A4
- Sheet
- of
- Revision:
- File:
- Date:
- (in symbol POL_CAP) +

### Library data of the parts
C12 C15-C18 = Capacitor: Capacitor ceramico 100nF x 50v
C13 = POL_CAP: Capacitor Polarizado EEE-FK1V101P
C14 = POL_CAP: Capacitor polarizado EMVY250ADA331MHA0G
CN19 = CONN_03P: Connector Generic 3 Vias
D323 = SCHOTTKY_DIODE: Diodo Schottky
D324 = TVS_DIODE: Diodo supresor
D325 = SCHOTTKY_DIODE: Diodo Schottky SBRD10200TR
D326 = LED_DIODE: LED rojo 0805
L1 = Inductor: 732-11717-ND
P1 = Polyswitch
R100 = Resistor
U5 = Integrado-LM2576S: Driver Switching
U6 U7 = Linear_Regulator: Regulador Lineal

## Nets that join several sheets
+3.3V: SCH_WifiNode (7 pins), SCH_PWR (C18.1 U7.3)
+5: SCH_CPU (10 pins), SCH_RTC (13 pins), SCH_PWR (C16.1 C17.1 U6.3 U7.1)
+12: SCH_POTENCIA (8 pins), SCH_PWR (6 pins)
GND: SCH_SEGEMENTOS_HORA_2 (8 pins), SCH_CPU (13 pins), SCH_WifiNode (C9.1 C10.1 C11.1 U4.15), SCH_RTC (14 pins), SCH_POTENCIA (20 pins), SCH_SEGEMENTOS_HORA_1 (8 pins), SCH_SEGEMENTOS_MINUTERO_1 (8 pins), SCH_SEGEMENTOS_MINUTERO_2 (8 pins), SCH_PWR (6 pins)
NetR8_1: SCH_CPU (U1.24), SCH_POTENCIA (R8.1)
NetR9_1: SCH_CPU (U1.25), SCH_POTENCIA (R9.1)
NetR12_1: SCH_CPU (U1.12), SCH_POTENCIA (R12.1)
NetR13_1: SCH_CPU (U1.26), SCH_POTENCIA (R13.1)
NetR16_1: SCH_CPU (U1.13), SCH_POTENCIA (R16.1)
NetR17_1: SCH_CPU (U1.32), SCH_POTENCIA (R17.1)
NetR20_1: SCH_CPU (U1.14), SCH_POTENCIA (R20.1)
NetR21_1: SCH_CPU (U1.1), SCH_POTENCIA (R21.1)
NetR24_1: SCH_CPU (U1.15), SCH_POTENCIA (R24.1)
NetR26_1: SCH_CPU (U1.23), SCH_POTENCIA (R26.1)
NetR28_1: SCH_CPU (U1.16), SCH_POTENCIA (R28.1)
NetR30_1: SCH_CPU (U1.17), SCH_POTENCIA (R30.1)
NetU1_30: SCH_CPU (U1.30), SCH_WifiNode (U4.22)
NetU1_31: SCH_CPU (U1.31), SCH_WifiNode (U4.21)
SCL: SCH_CPU (U1.27), SCH_RTC (RP1.2 U2.6 U3.9)
SDA: SCH_CPU (U1.28), SCH_RTC (RP1.4 U2.5 U3.10)